# EAGLE schematic Cube_sch_3_16_13 (EAGLE 6.4), part 1 of 2
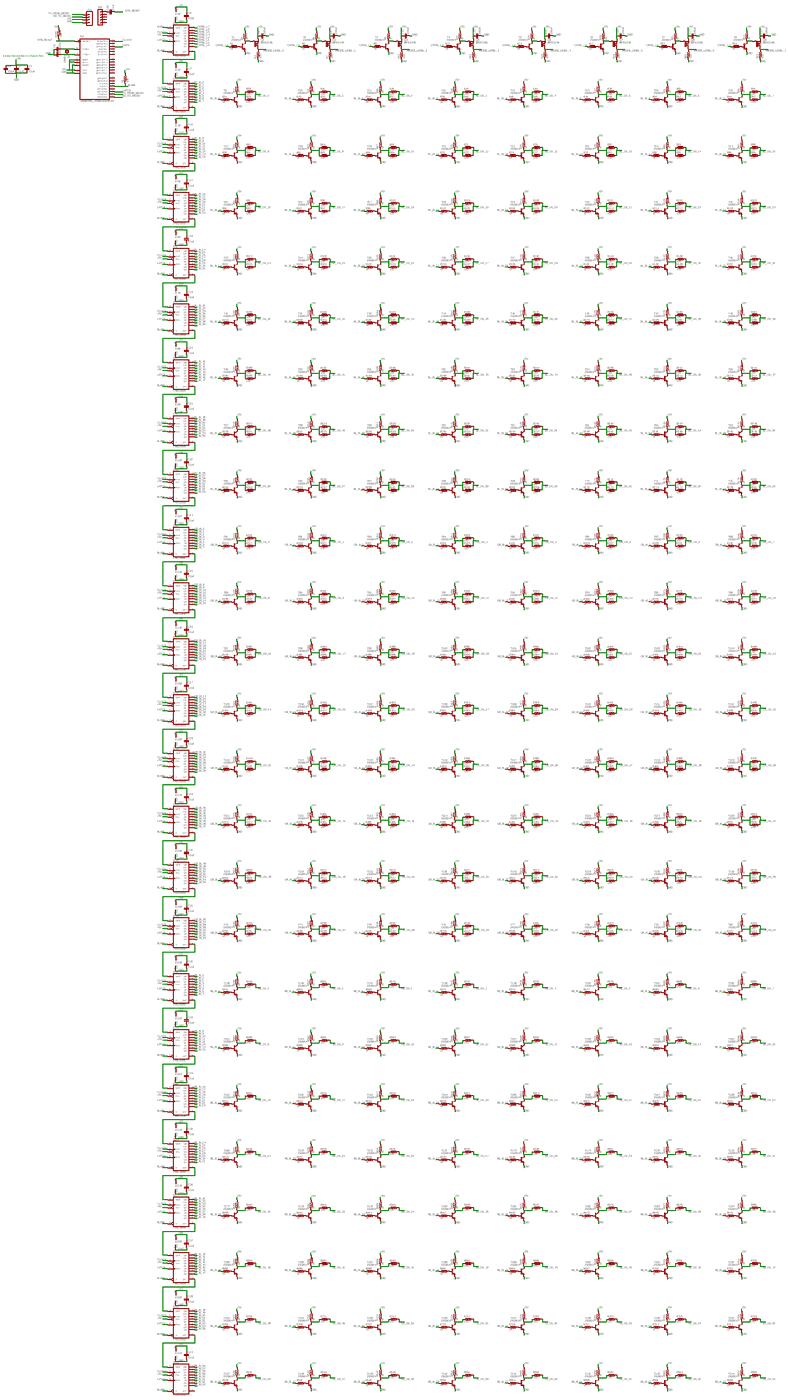
[diagram p0: schematic, sheet 1, overview]
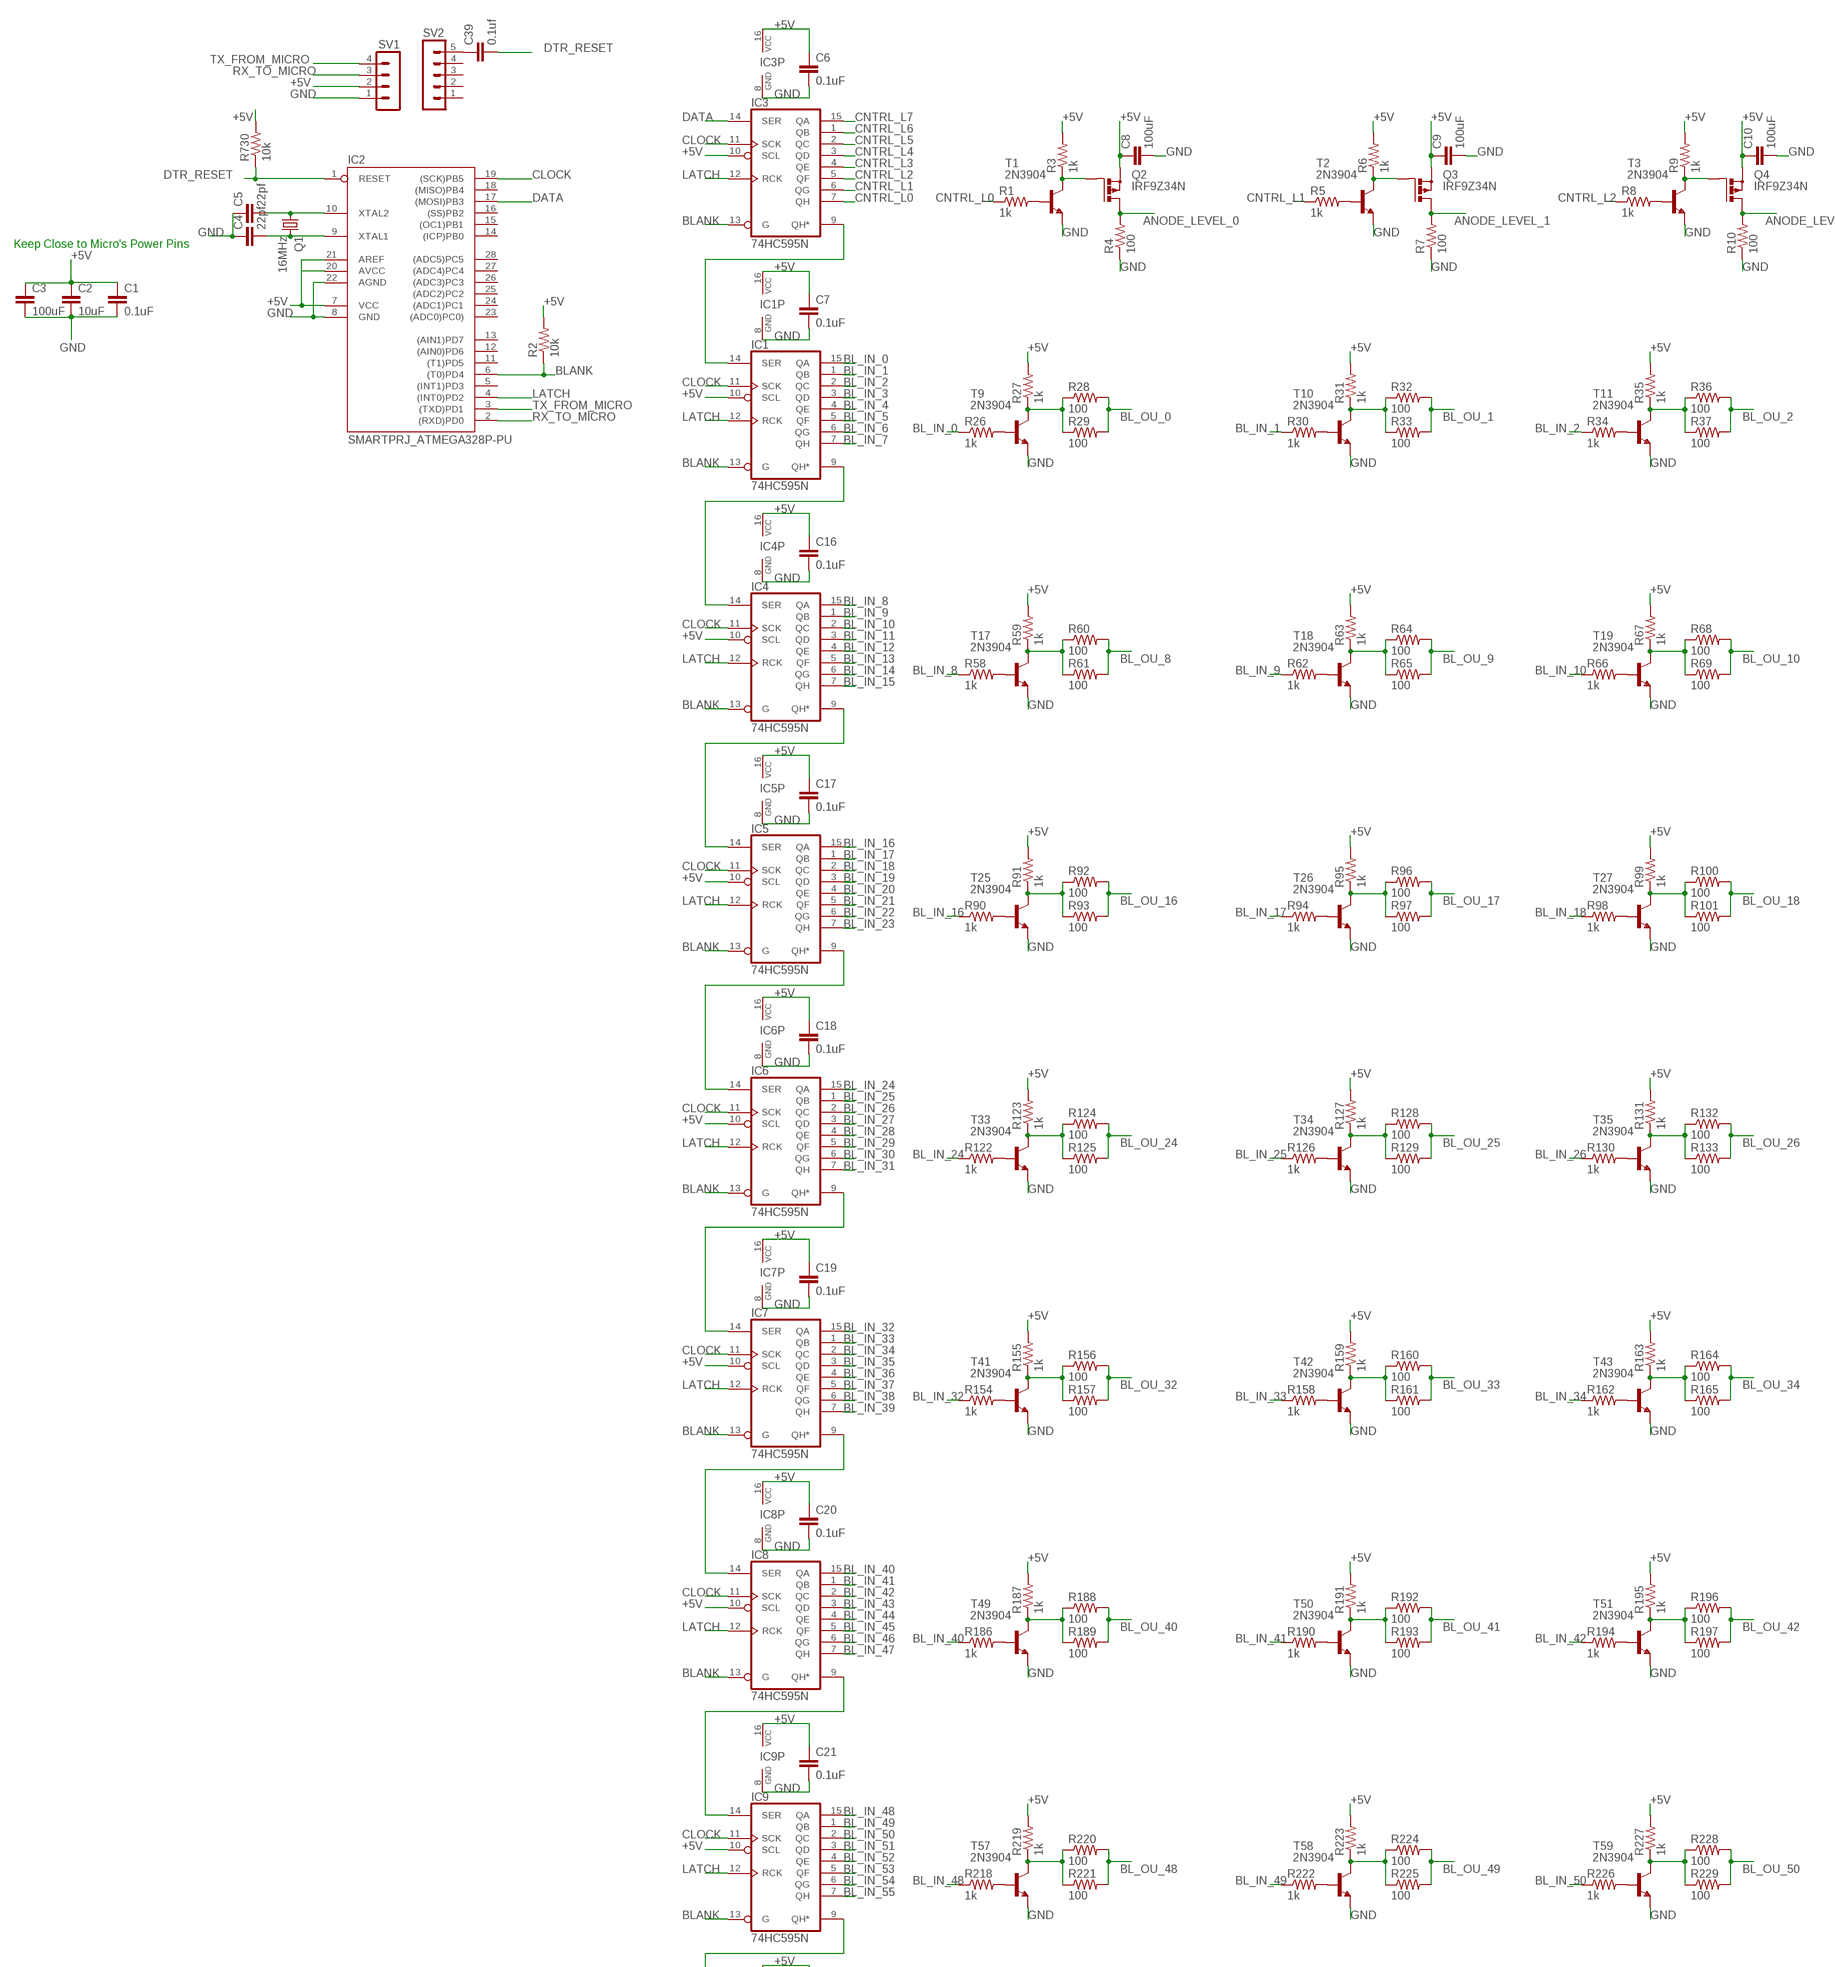
[diagram p1: schematic, sheet 1, part 1 of 8]
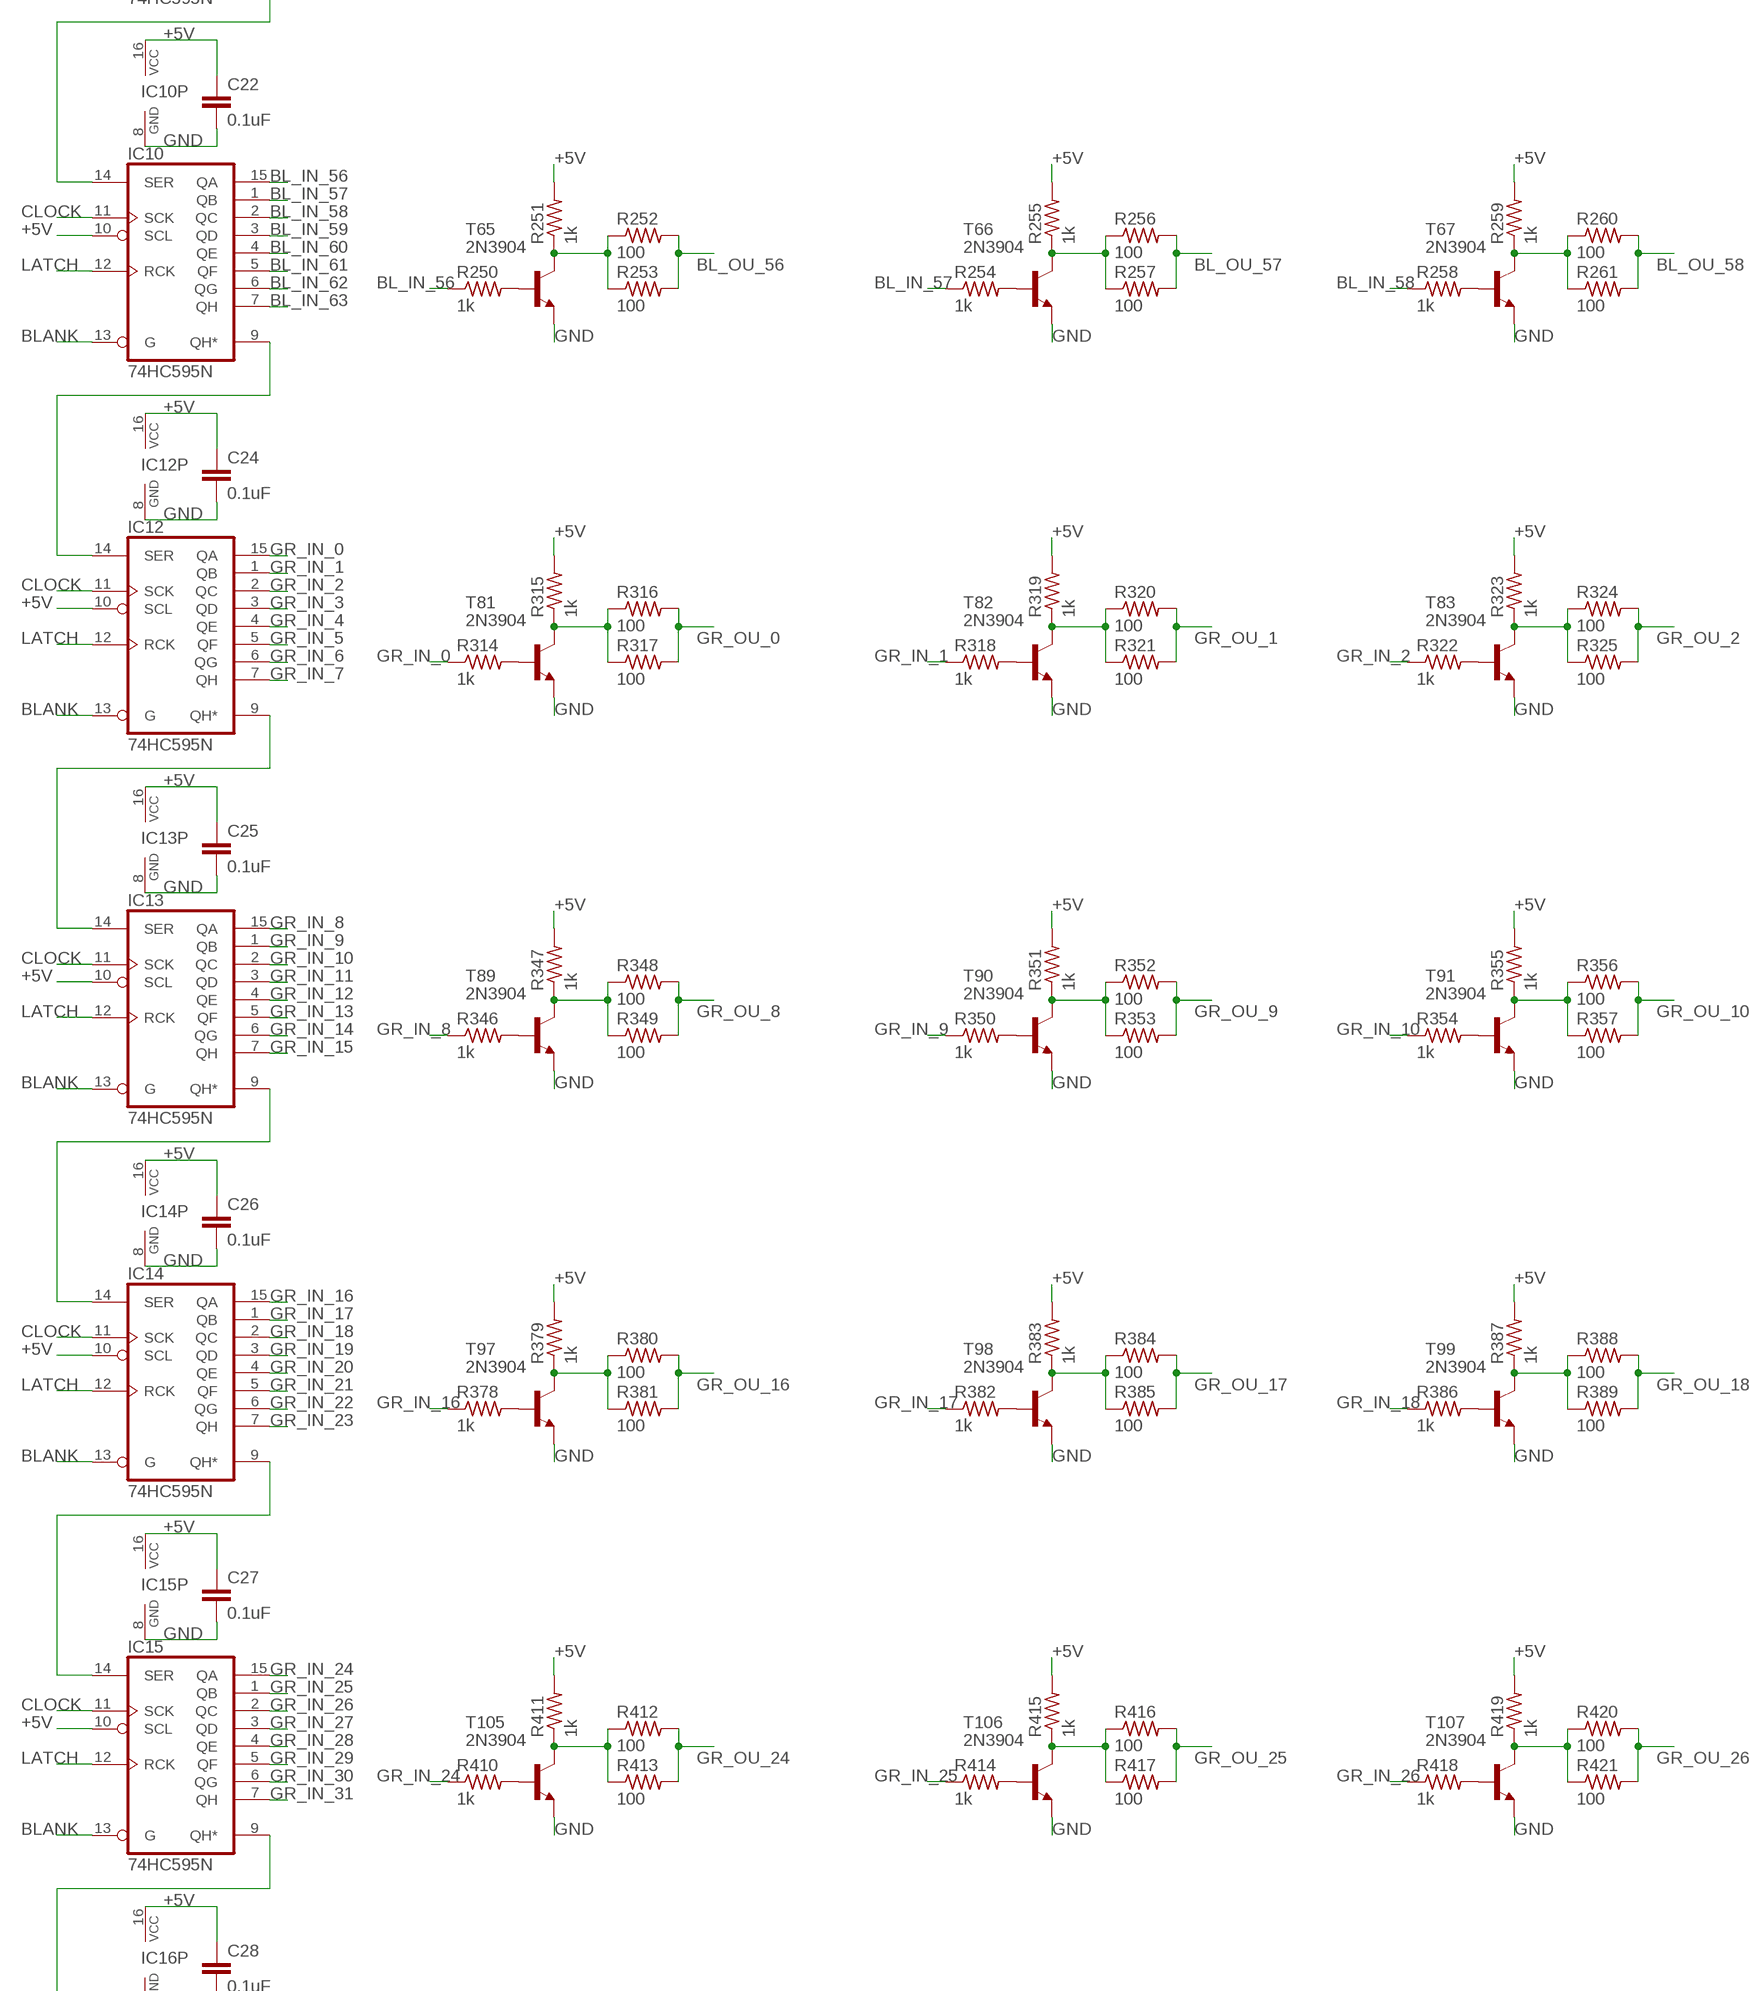
[diagram p2: schematic, sheet 1, part 2 of 8]
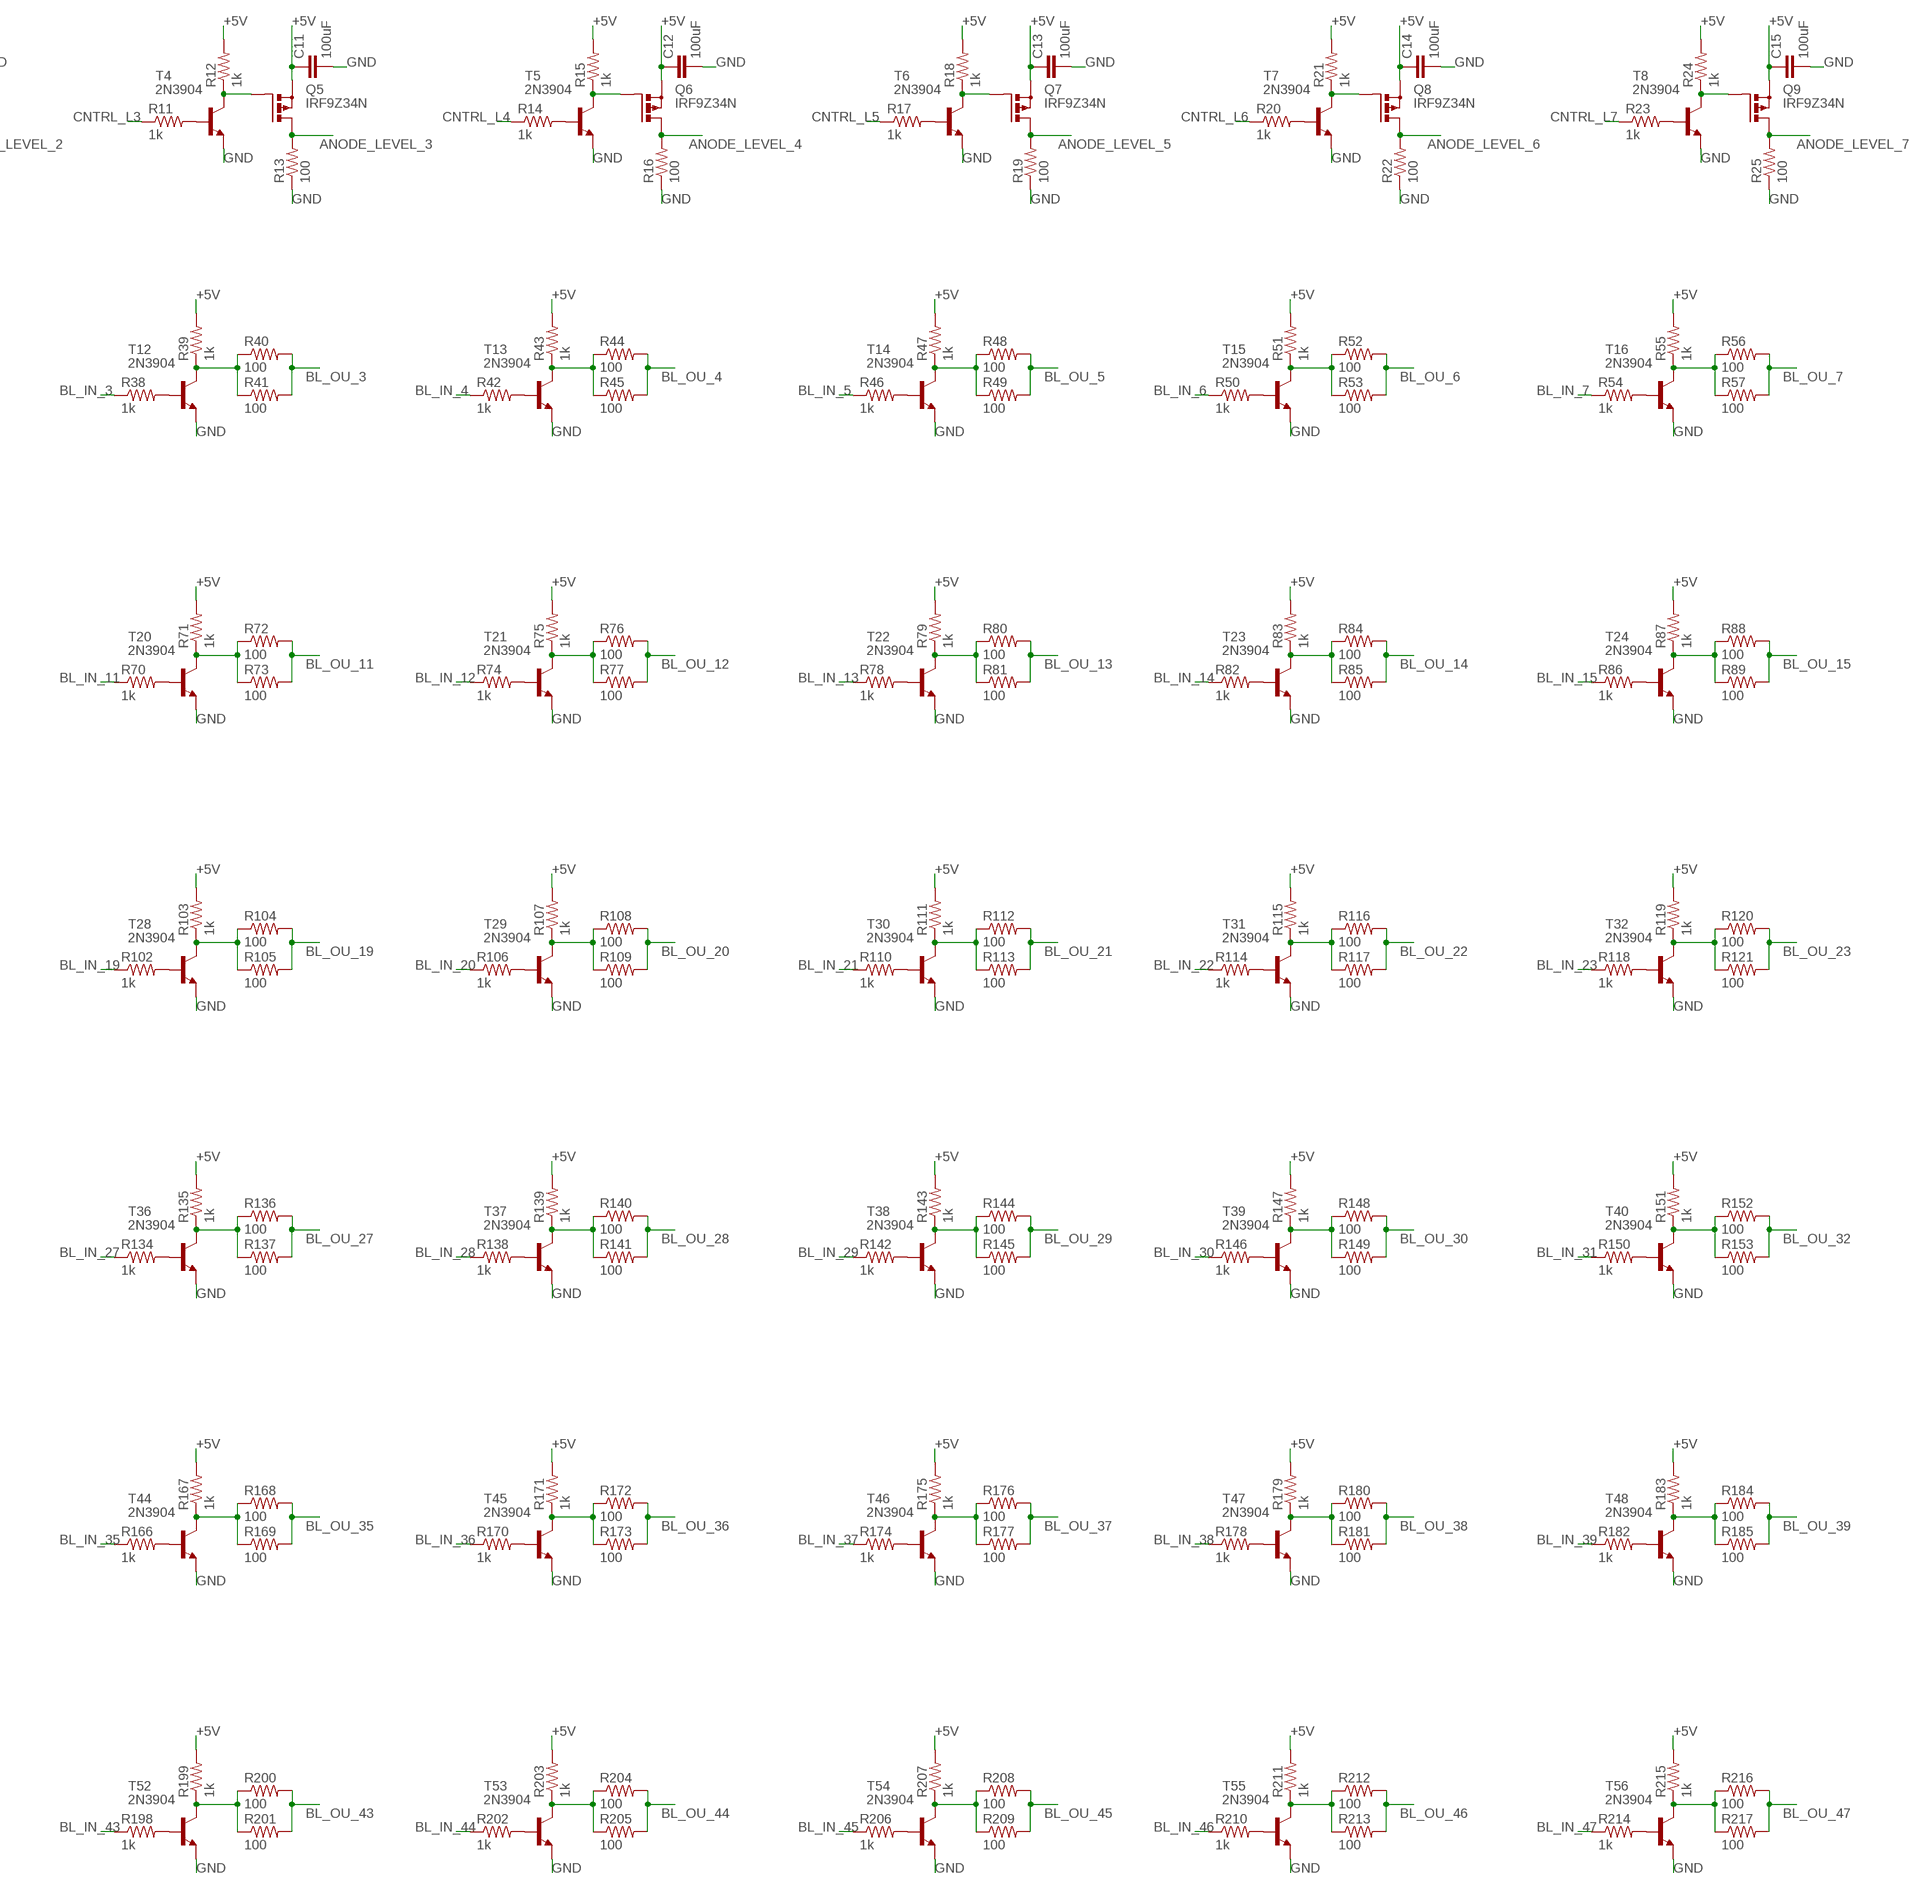
[diagram p3: schematic, sheet 1, part 3 of 8]
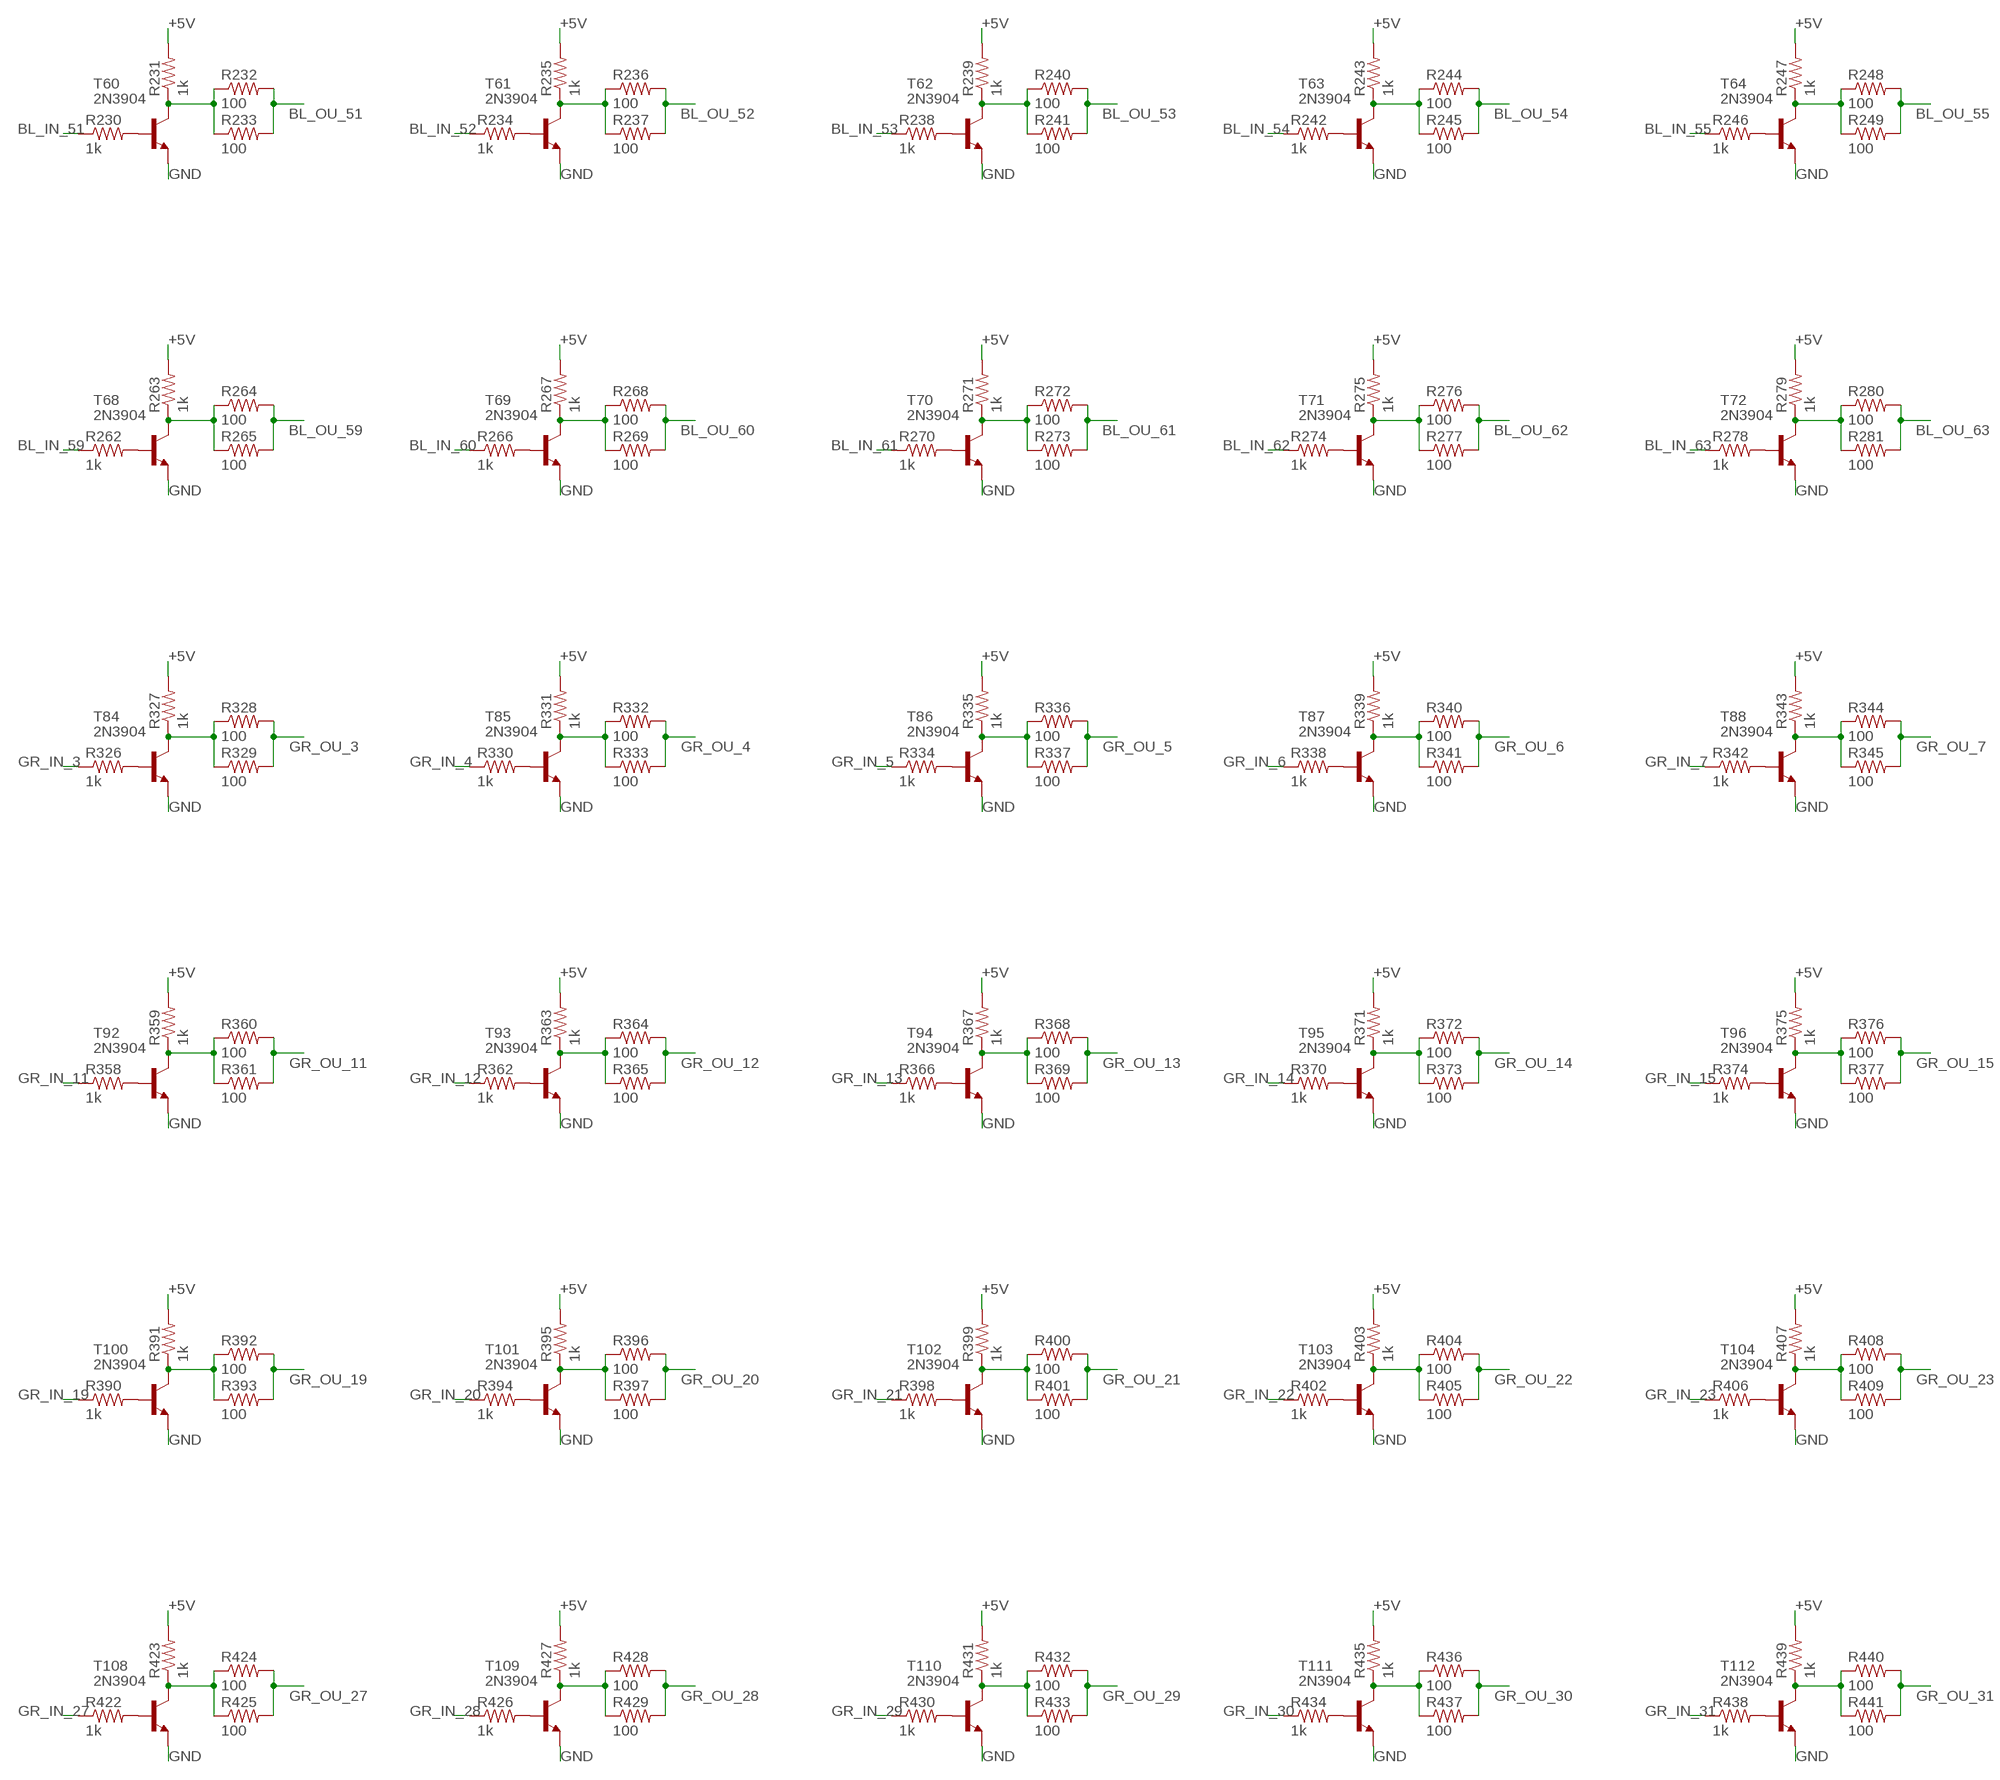
[diagram p4: schematic, sheet 1, part 4 of 8]
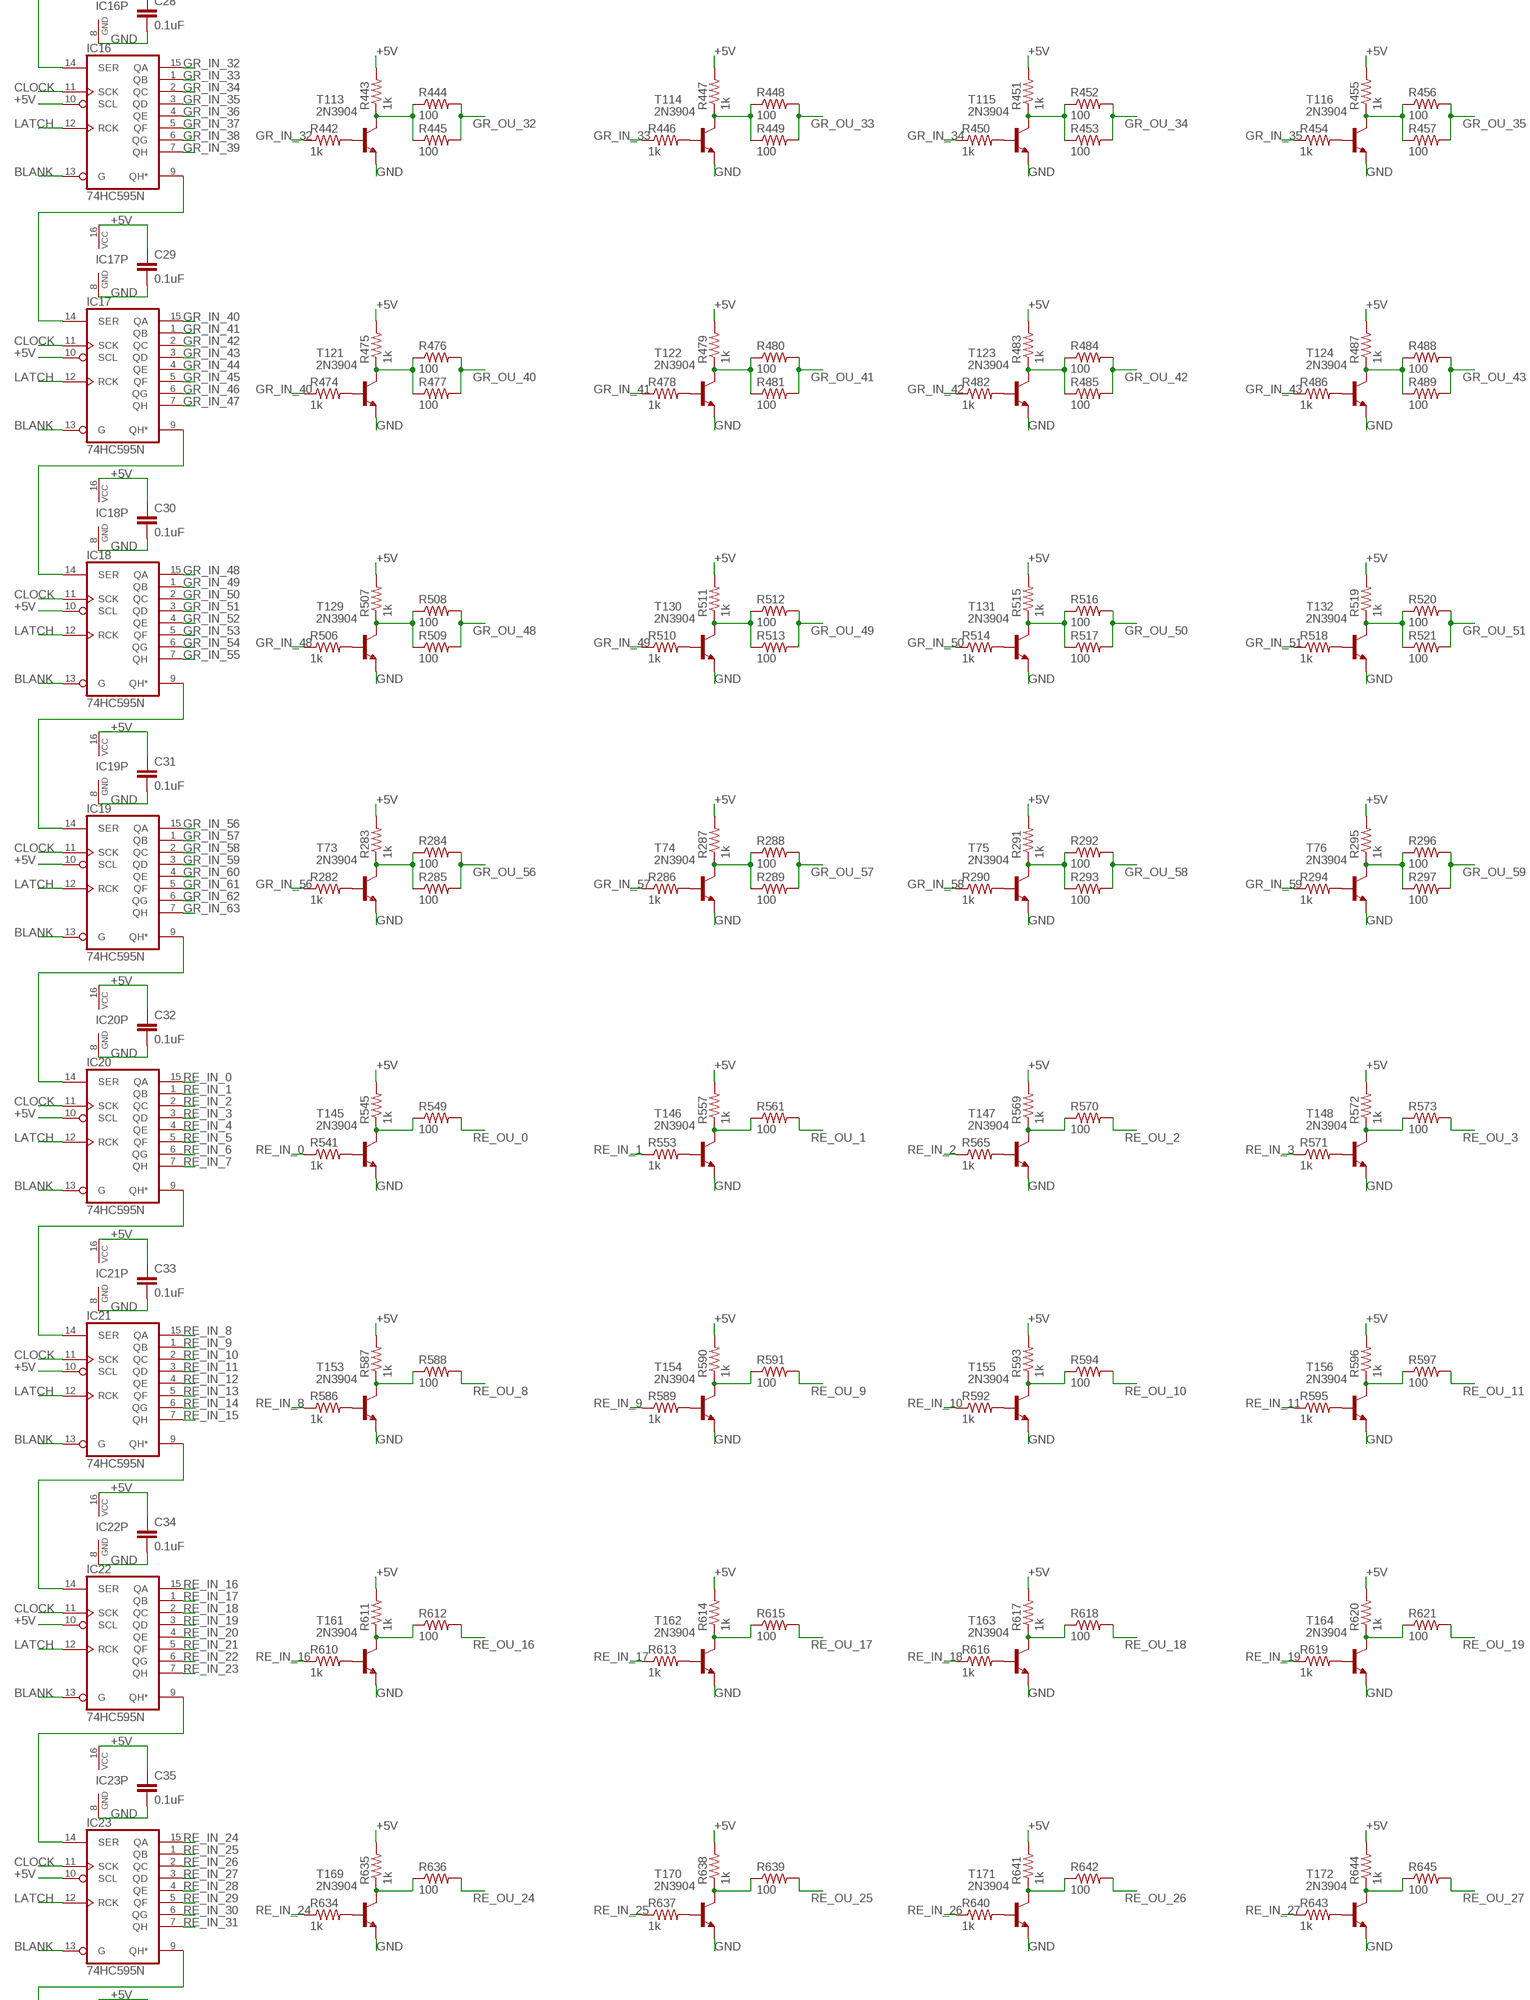
[diagram p5: schematic, sheet 1, part 5 of 8]
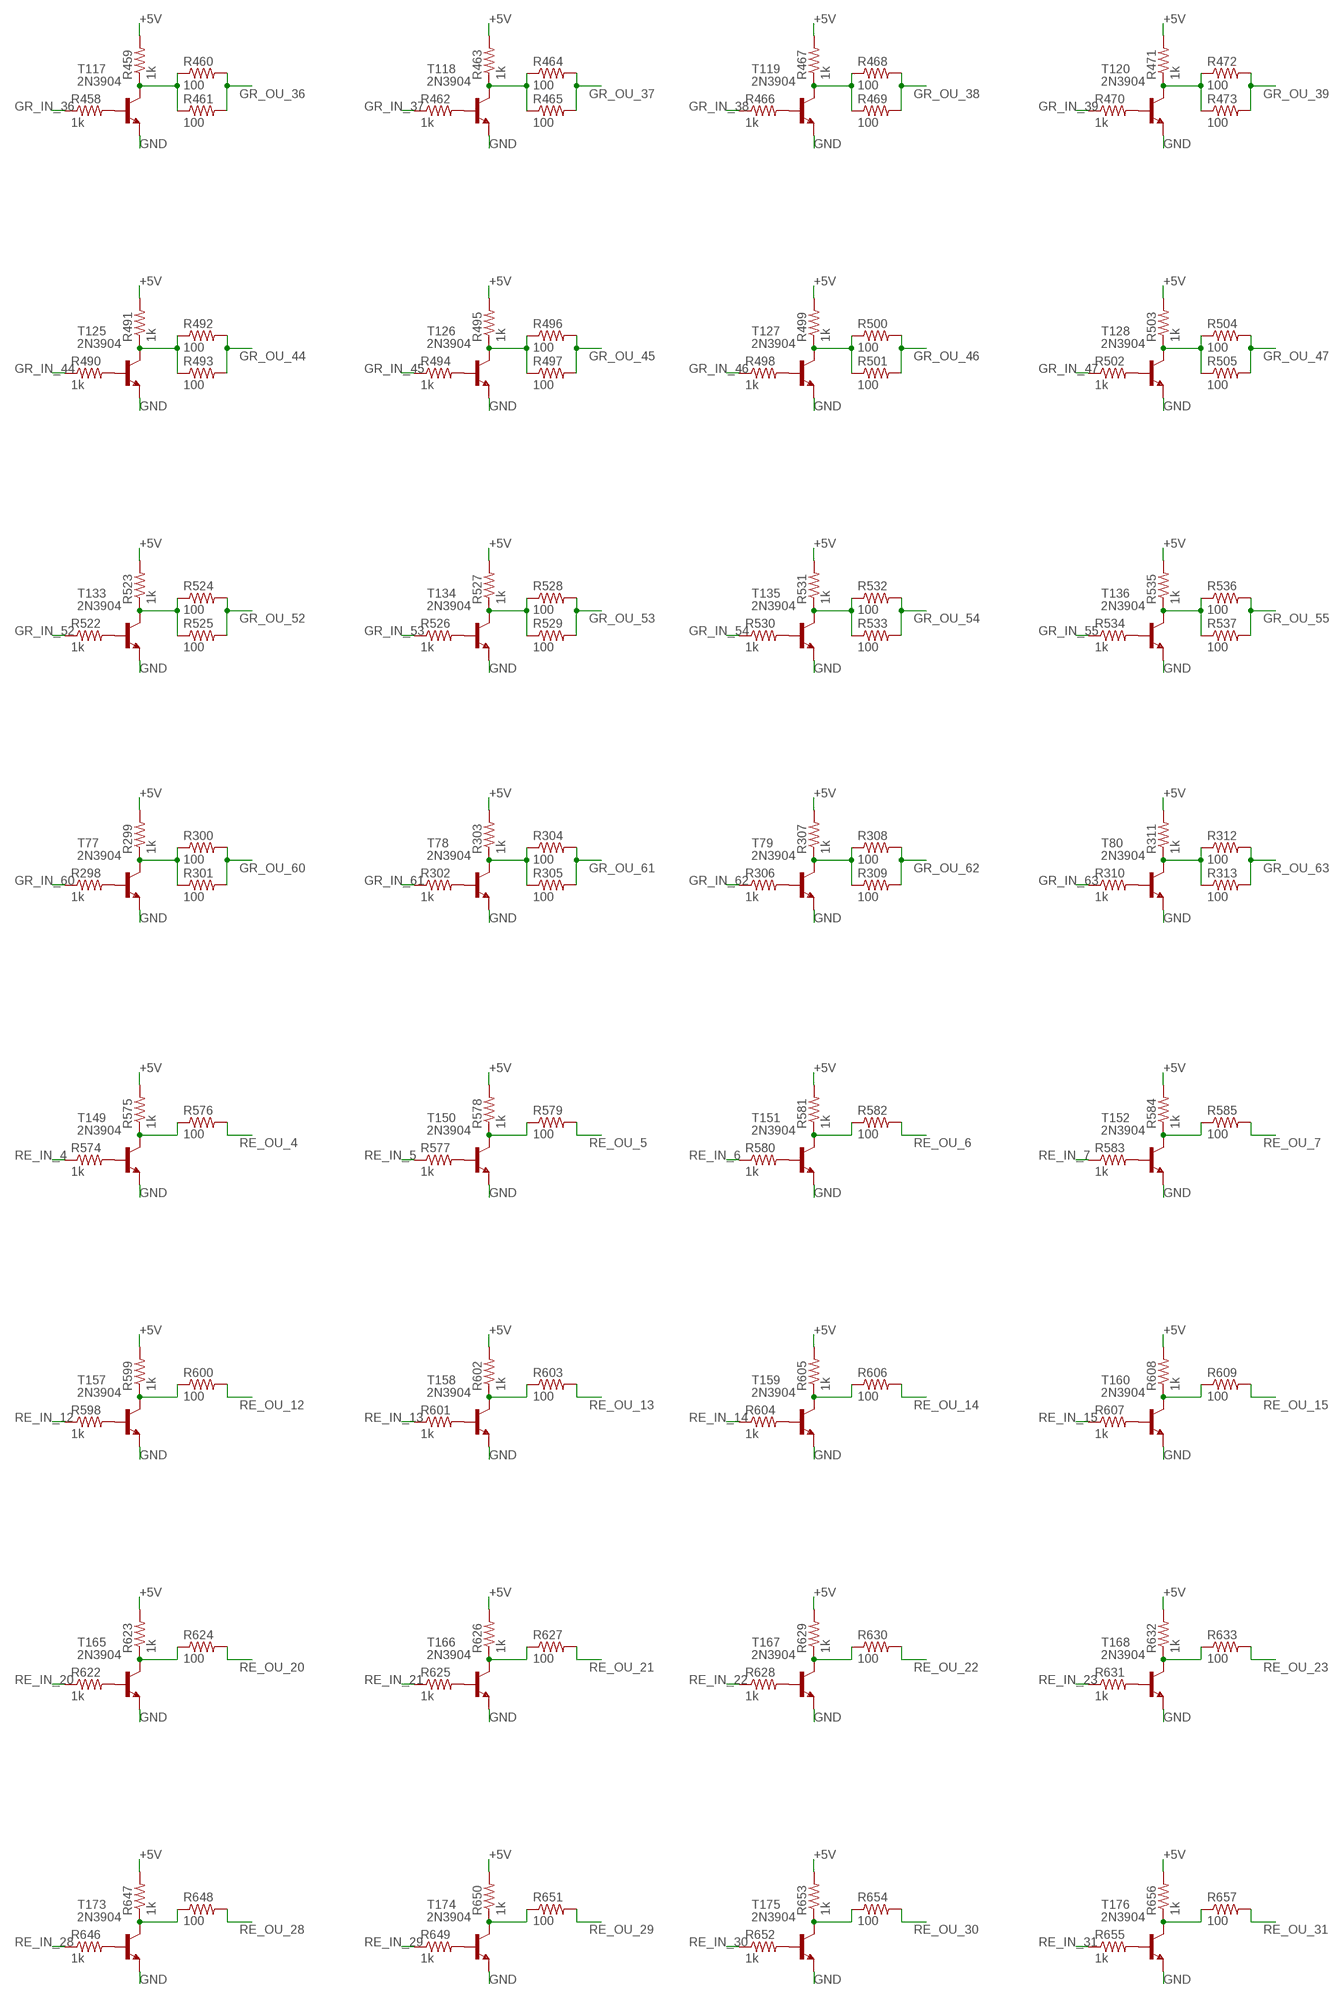
[diagram p6: schematic, sheet 1, part 6 of 8]
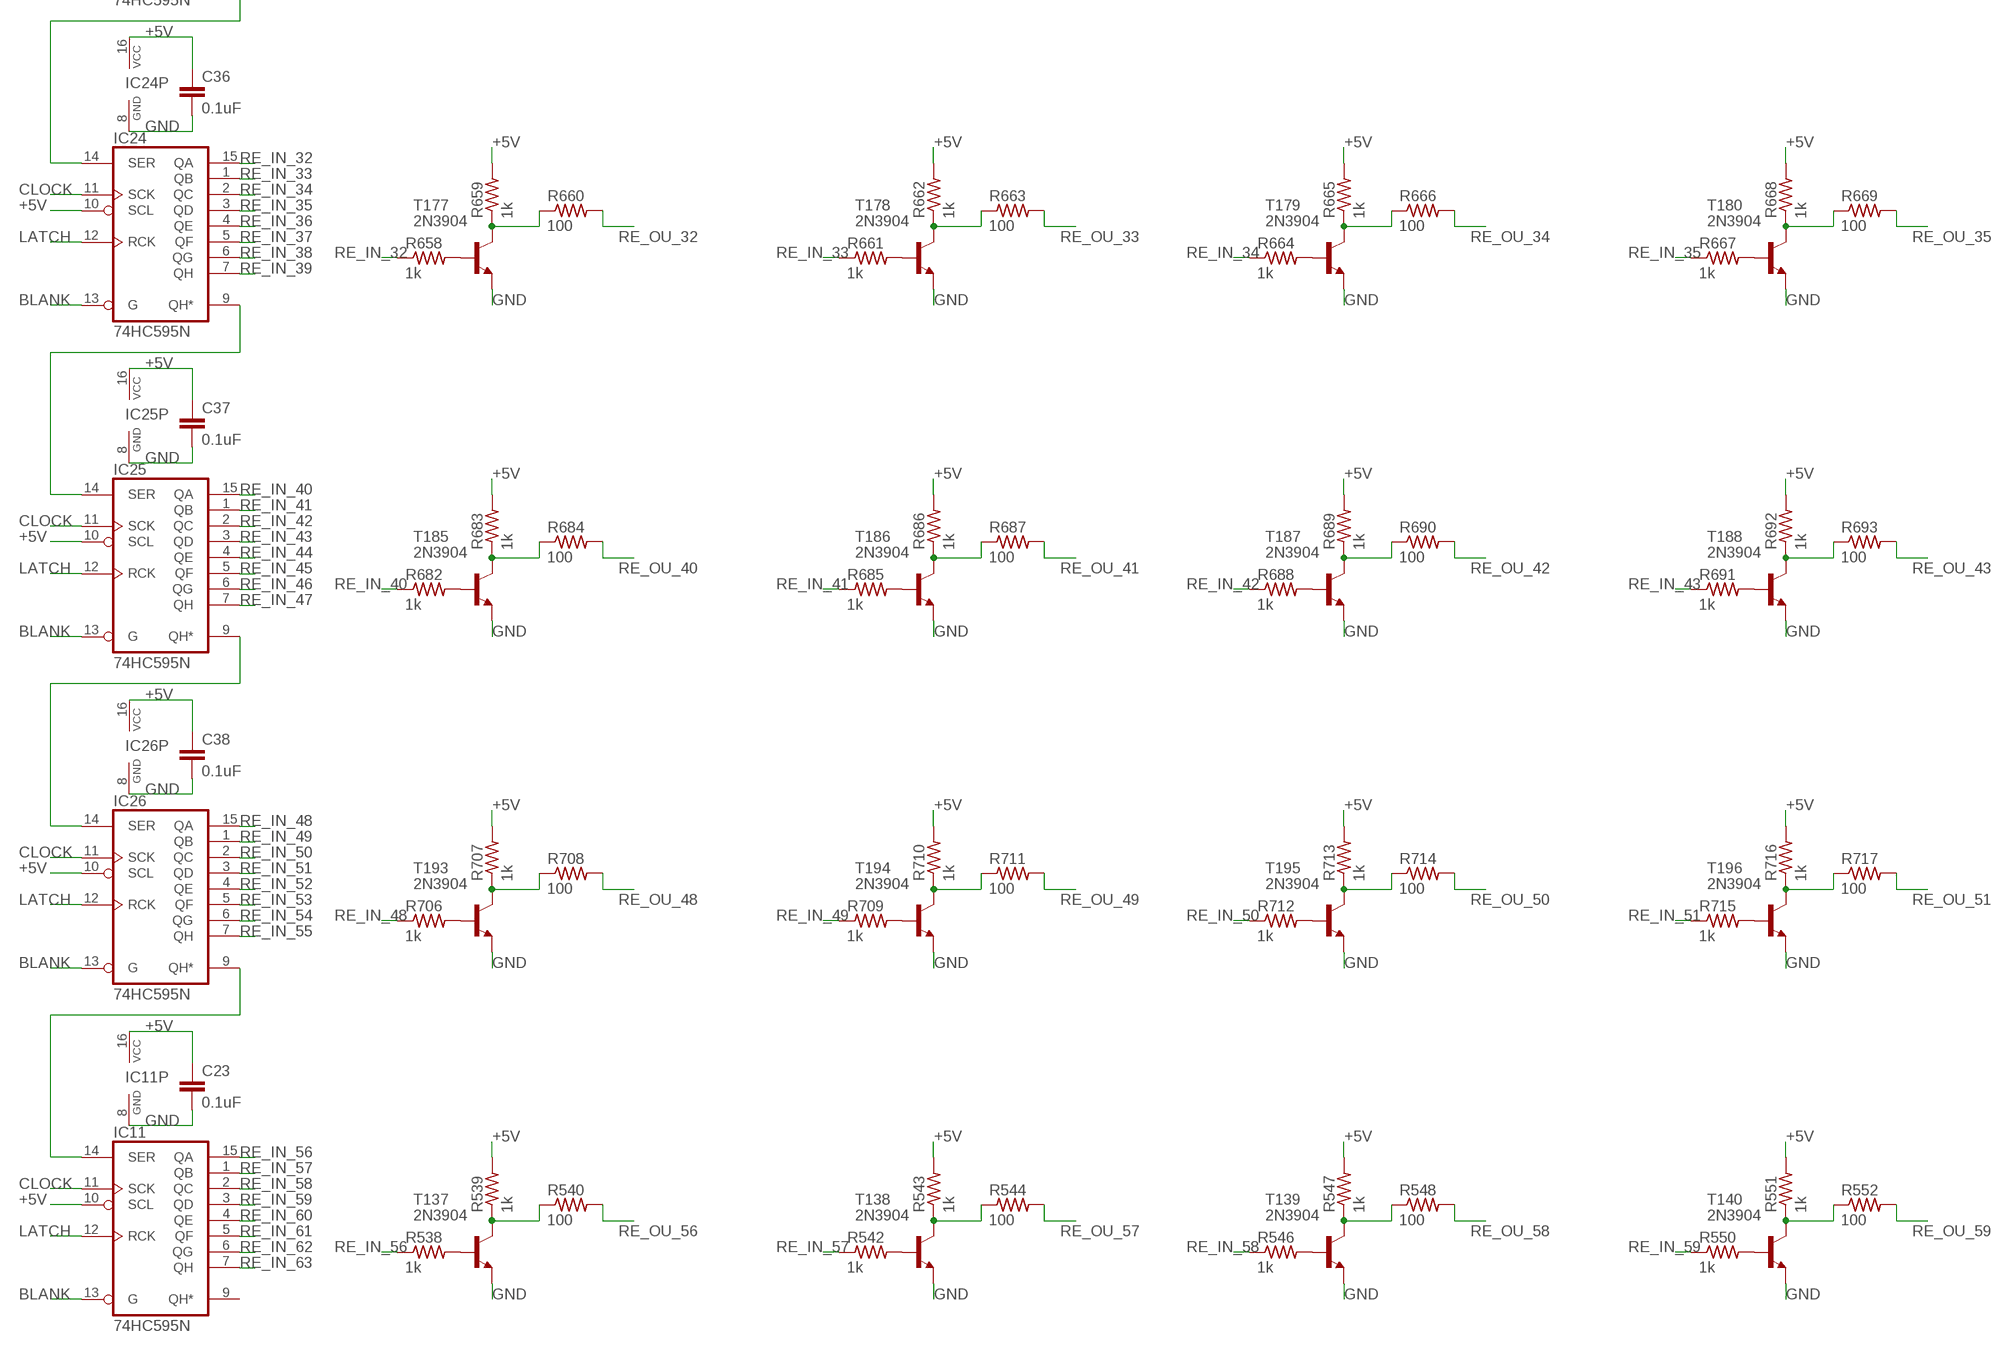
[diagram p7: schematic, sheet 1, part 7 of 8]
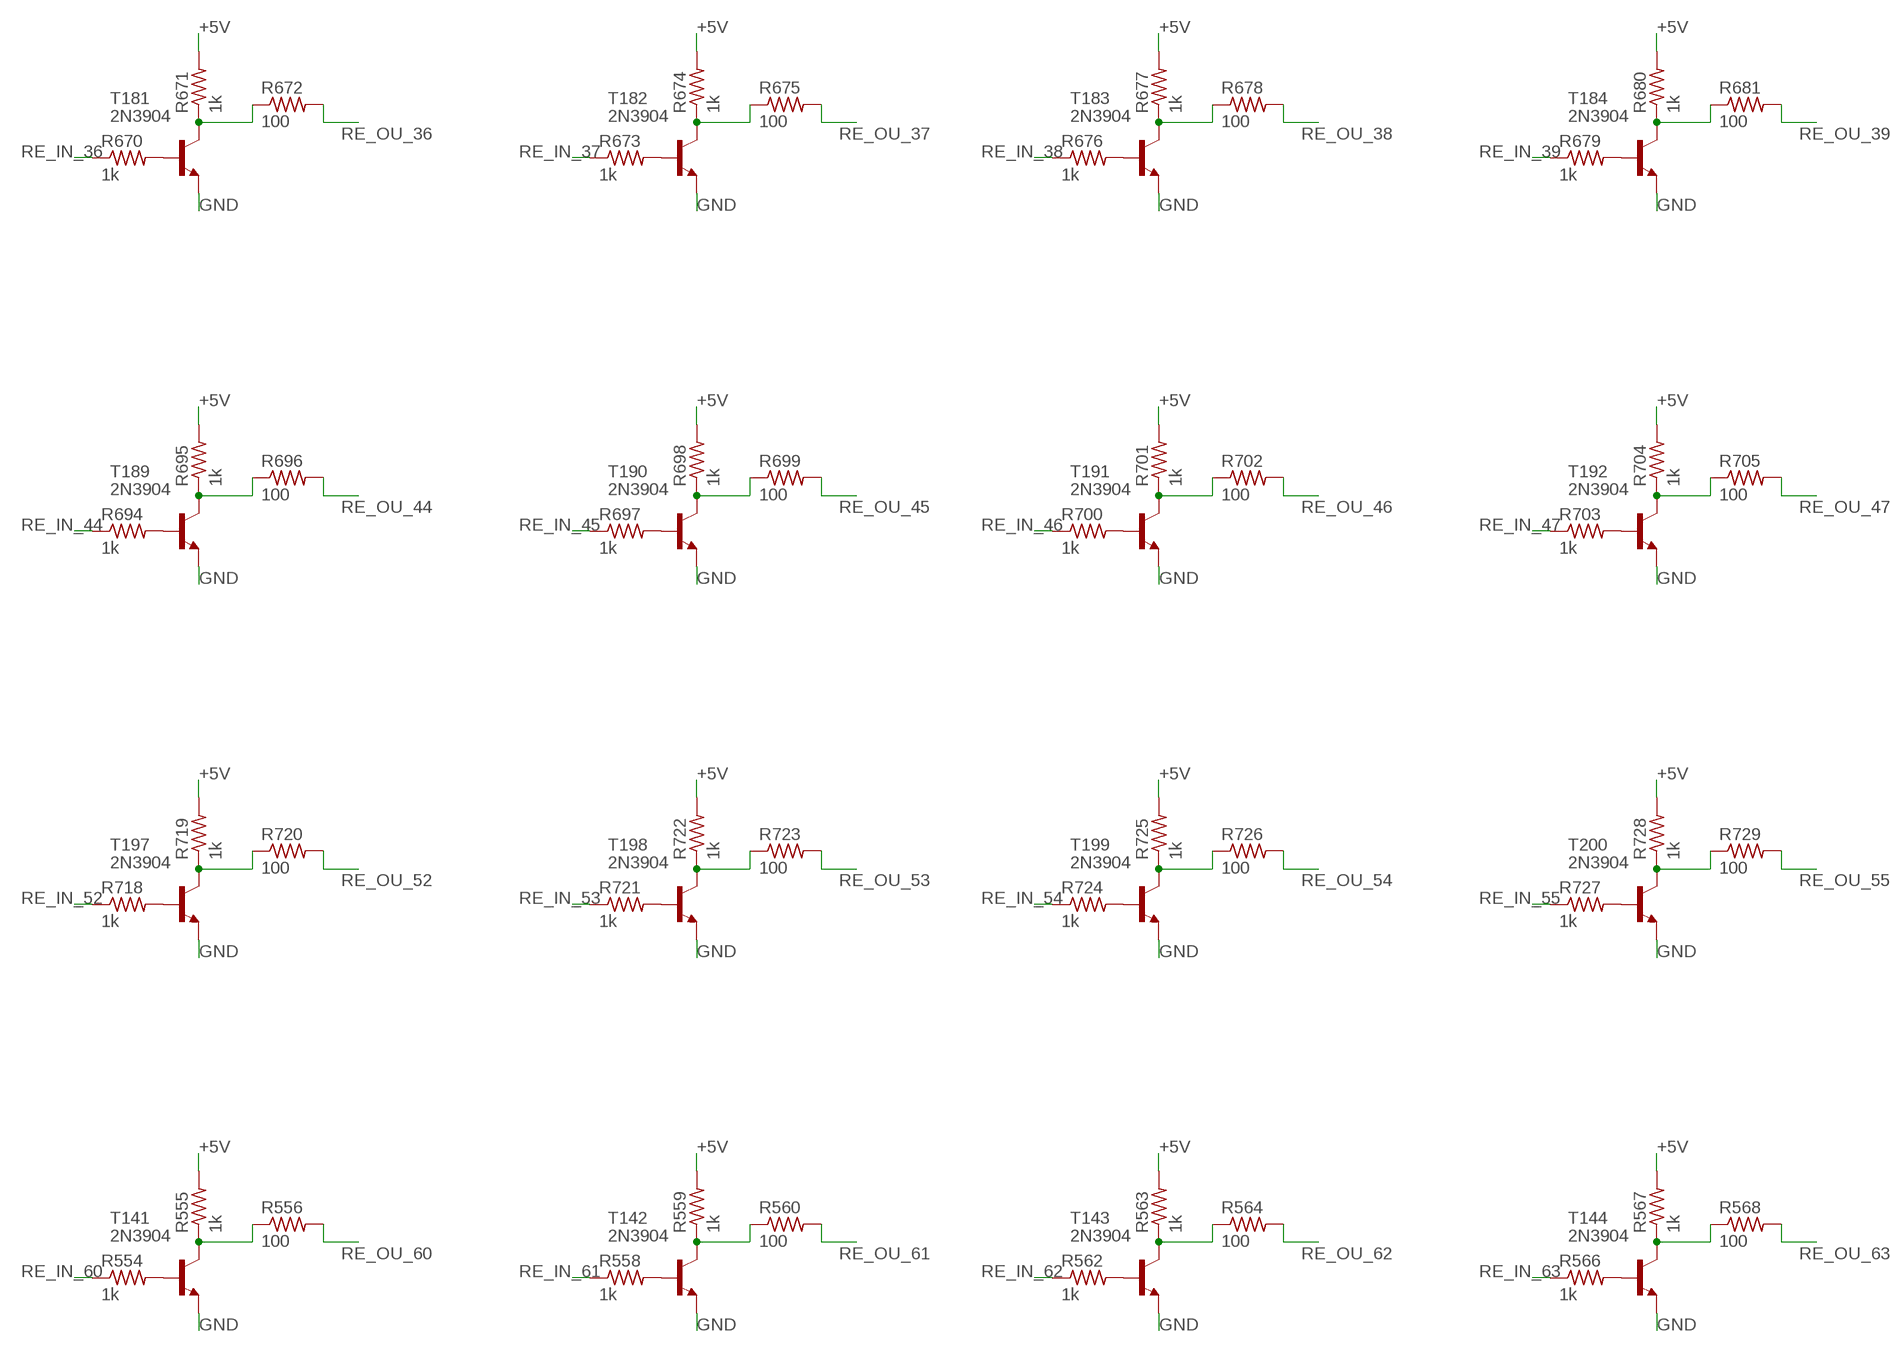
[diagram p8: schematic, sheet 1, part 8 of 8]

## Parts
C1  0.1uF  C2,5-3  [C2.5-3]
C2  10uF  C2,5-3  [C2.5-3]
C3  100uF  C2,5-3  [C2.5-3]
C4  22pf  C2,5-3  [C2.5-3]
C5  22pf  C2,5-3  [C2.5-3]
C6  0.1uF  C2,5-3  [C2.5-3]
C7  0.1uF  C2,5-3  [C2.5-3]
C8  100uF  C2,5-3  [C2.5-3]
C9  100uF  C2,5-3  [C2.5-3]
C10  100uF  C2,5-3  [C2.5-3]
C11  100uF  C2,5-3  [C2.5-3]
C12  100uF  C2,5-3  [C2.5-3]
C13  100uF  C2,5-3  [C2.5-3]
C14  100uF  C2,5-3  [C2.5-3]
C15  100uF  C2,5-3  [C2.5-3]
C16  0.1uF  C2,5-3  [C2.5-3]
C17  0.1uF  C2,5-3  [C2.5-3]
C18  0.1uF  C2,5-3  [C2.5-3]
C19  0.1uF  C2,5-3  [C2.5-3]
C20  0.1uF  C2,5-3  [C2.5-3]
C21  0.1uF  C2,5-3  [C2.5-3]
C22  0.1uF  C2,5-3  [C2.5-3]
C23  0.1uF  C2,5-3  [C2.5-3]
C24  0.1uF  C2,5-3  [C2.5-3]
C25  0.1uF  C2,5-3  [C2.5-3]
C26  0.1uF  C2,5-3  [C2.5-3]
C27  0.1uF  C2,5-3  [C2.5-3]
C28  0.1uF  C2,5-3  [C2.5-3]
C29  0.1uF  C2,5-3  [C2.5-3]
C30  0.1uF  C2,5-3  [C2.5-3]
C31  0.1uF  C2,5-3  [C2.5-3]
C32  0.1uF  C2,5-3  [C2.5-3]
C33  0.1uF  C2,5-3  [C2.5-3]
C34  0.1uF  C2,5-3  [C2.5-3]
C35  0.1uF  C2,5-3  [C2.5-3]
C36  0.1uF  C2,5-3  [C2.5-3]
C37  0.1uF  C2,5-3  [C2.5-3]
C38  0.1uF  C2,5-3  [C2.5-3]
C39  0.1uf  C2,5-3  [C2.5-3]
IC1  74HC595N  [DIL16]
IC2  SMARTPRJ_ATMEGA328P-PU  [SMARTPRJ_DIL28-3]
IC3  74HC595N  [DIL16]
IC4  74HC595N  [DIL16]
IC5  74HC595N  [DIL16]
IC6  74HC595N  [DIL16]
IC7  74HC595N  [DIL16]
IC8  74HC595N  [DIL16]
IC9  74HC595N  [DIL16]
IC10  74HC595N  [DIL16]
IC11  74HC595N  [DIL16]
IC12  74HC595N  [DIL16]
IC13  74HC595N  [DIL16]
IC14  74HC595N  [DIL16]
IC15  74HC595N  [DIL16]
IC16  74HC595N  [DIL16]
IC17  74HC595N  [DIL16]
IC18  74HC595N  [DIL16]
IC19  74HC595N  [DIL16]
IC20  74HC595N  [DIL16]
IC21  74HC595N  [DIL16]
IC22  74HC595N  [DIL16]
IC23  74HC595N  [DIL16]
IC24  74HC595N  [DIL16]
IC25  74HC595N  [DIL16]
IC26  74HC595N  [DIL16]
Q1  16MHz  CRYSTALHC49S  [HC49/S]
Q2  IRF9Z34N  PMOSFET_PTO220BV  [TO220BV]
Q3  IRF9Z34N  PMOSFET_PTO220BV  [TO220BV]
Q4  IRF9Z34N  PMOSFET_PTO220BV  [TO220BV]
Q5  IRF9Z34N  PMOSFET_PTO220BV  [TO220BV]
Q6  IRF9Z34N  PMOSFET_PTO220BV  [TO220BV]
Q7  IRF9Z34N  PMOSFET_PTO220BV  [TO220BV]
Q8  IRF9Z34N  PMOSFET_PTO220BV  [TO220BV]
Q9  IRF9Z34N  PMOSFET_PTO220BV  [TO220BV]
R1  1k  R-US_0204/5  [0204/5]
R2  10k  R-US_0204/5  [0204/5]
R3  1k  R-US_0204/5  [0204/5]
R4  100  R-US_0204/5  [0204/5]
R5  1k  R-US_0204/5  [0204/5]
R6  1k  R-US_0204/5  [0204/5]
R7  100  R-US_0204/5  [0204/5]
R8  1k  R-US_0204/5  [0204/5]
R9  1k  R-US_0204/5  [0204/5]
R10  100  R-US_0204/5  [0204/5]
R11  1k  R-US_0204/5  [0204/5]
R12  1k  R-US_0204/5  [0204/5]
R13  100  R-US_0204/5  [0204/5]
R14  1k  R-US_0204/5  [0204/5]
R15  1k  R-US_0204/5  [0204/5]
R16  100  R-US_0204/5  [0204/5]
R17  1k  R-US_0204/5  [0204/5]
R18  1k  R-US_0204/5  [0204/5]
R19  100  R-US_0204/5  [0204/5]
R20  1k  R-US_0204/5  [0204/5]
R21  1k  R-US_0204/5  [0204/5]
R22  100  R-US_0204/5  [0204/5]
R23  1k  R-US_0204/5  [0204/5]
R24  1k  R-US_0204/5  [0204/5]
R25  100  R-US_0204/5  [0204/5]
R26  1k  R-US_0204/5  [0204/5]
R27  1k  R-US_0204/5  [0204/5]
R28  100  R-US_0204/5  [0204/5]
R29  100  R-US_0204/5  [0204/5]
R30  1k  R-US_0204/5  [0204/5]
R31  1k  R-US_0204/5  [0204/5]
R32  100  R-US_0204/5  [0204/5]
R33  100  R-US_0204/5  [0204/5]
R34  1k  R-US_0204/5  [0204/5]
R35  1k  R-US_0204/5  [0204/5]
R36  100  R-US_0204/5  [0204/5]
R37  100  R-US_0204/5  [0204/5]
R38  1k  R-US_0204/5  [0204/5]
R39  1k  R-US_0204/5  [0204/5]
R40  100  R-US_0204/5  [0204/5]
R41  100  R-US_0204/5  [0204/5]
R42  1k  R-US_0204/5  [0204/5]
R43  1k  R-US_0204/5  [0204/5]
R44  100  R-US_0204/5  [0204/5]
R45  100  R-US_0204/5  [0204/5]
R46  1k  R-US_0204/5  [0204/5]
R47  1k  R-US_0204/5  [0204/5]
R48  100  R-US_0204/5  [0204/5]
R49  100  R-US_0204/5  [0204/5]
R50  1k  R-US_0204/5  [0204/5]
R51  1k  R-US_0204/5  [0204/5]
R52  100  R-US_0204/5  [0204/5]
R53  100  R-US_0204/5  [0204/5]
R54  1k  R-US_0204/5  [0204/5]
R55  1k  R-US_0204/5  [0204/5]
R56  100  R-US_0204/5  [0204/5]
R57  100  R-US_0204/5  [0204/5]
R58  1k  R-US_0204/5  [0204/5]
R59  1k  R-US_0204/5  [0204/5]
R60  100  R-US_0204/5  [0204/5]
R61  100  R-US_0204/5  [0204/5]
R62  1k  R-US_0204/5  [0204/5]
R63  1k  R-US_0204/5  [0204/5]
R64  100  R-US_0204/5  [0204/5]
R65  100  R-US_0204/5  [0204/5]
R66  1k  R-US_0204/5  [0204/5]
R67  1k  R-US_0204/5  [0204/5]
R68  100  R-US_0204/5  [0204/5]
R69  100  R-US_0204/5  [0204/5]
R70  1k  R-US_0204/5  [0204/5]
R71  1k  R-US_0204/5  [0204/5]
R72  100  R-US_0204/5  [0204/5]
R73  100  R-US_0204/5  [0204/5]
R74  1k  R-US_0204/5  [0204/5]
R75  1k  R-US_0204/5  [0204/5]
R76  100  R-US_0204/5  [0204/5]
R77  100  R-US_0204/5  [0204/5]
R78  1k  R-US_0204/5  [0204/5]
R79  1k  R-US_0204/5  [0204/5]
R80  100  R-US_0204/5  [0204/5]
R81  100  R-US_0204/5  [0204/5]
R82  1k  R-US_0204/5  [0204/5]
R83  1k  R-US_0204/5  [0204/5]
R84  100  R-US_0204/5  [0204/5]
R85  100  R-US_0204/5  [0204/5]
R86  1k  R-US_0204/5  [0204/5]
R87  1k  R-US_0204/5  [0204/5]
R88  100  R-US_0204/5  [0204/5]
R89  100  R-US_0204/5  [0204/5]
R90  1k  R-US_0204/5  [0204/5]
R91  1k  R-US_0204/5  [0204/5]
R92  100  R-US_0204/5  [0204/5]
R93  100  R-US_0204/5  [0204/5]
R94  1k  R-US_0204/5  [0204/5]
R95  1k  R-US_0204/5  [0204/5]
R96  100  R-US_0204/5  [0204/5]
R97  100  R-US_0204/5  [0204/5]
R98  1k  R-US_0204/5  [0204/5]
R99  1k  R-US_0204/5  [0204/5]
R100  100  R-US_0204/5  [0204/5]
R101  100  R-US_0204/5  [0204/5]
R102  1k  R-US_0204/5  [0204/5]
R103  1k  R-US_0204/5  [0204/5]
R104  100  R-US_0204/5  [0204/5]
R105  100  R-US_0204/5  [0204/5]
R106  1k  R-US_0204/5  [0204/5]
R107  1k  R-US_0204/5  [0204/5]
R108  100  R-US_0204/5  [0204/5]
R109  100  R-US_0204/5  [0204/5]
R110  1k  R-US_0204/5  [0204/5]
R111  1k  R-US_0204/5  [0204/5]
R112  100  R-US_0204/5  [0204/5]
R113  100  R-US_0204/5  [0204/5]
R114  1k  R-US_0204/5  [0204/5]
R115  1k  R-US_0204/5  [0204/5]
R116  100  R-US_0204/5  [0204/5]
R117  100  R-US_0204/5  [0204/5]
R118  1k  R-US_0204/5  [0204/5]
R119  1k  R-US_0204/5  [0204/5]
R120  100  R-US_0204/5  [0204/5]
R121  100  R-US_0204/5  [0204/5]
R122  1k  R-US_0204/5  [0204/5]
R123  1k  R-US_0204/5  [0204/5]
R124  100  R-US_0204/5  [0204/5]
R125  100  R-US_0204/5  [0204/5]
R126  1k  R-US_0204/5  [0204/5]
R127  1k  R-US_0204/5  [0204/5]
R128  100  R-US_0204/5  [0204/5]
R129  100  R-US_0204/5  [0204/5]
R130  1k  R-US_0204/5  [0204/5]
R131  1k  R-US_0204/5  [0204/5]
R132  100  R-US_0204/5  [0204/5]
R133  100  R-US_0204/5  [0204/5]
R134  1k  R-US_0204/5  [0204/5]
R135  1k  R-US_0204/5  [0204/5]
R136  100  R-US_0204/5  [0204/5]
R137  100  R-US_0204/5  [0204/5]
R138  1k  R-US_0204/5  [0204/5]
R139  1k  R-US_0204/5  [0204/5]
R140  100  R-US_0204/5  [0204/5]
R141  100  R-US_0204/5  [0204/5]
R142  1k  R-US_0204/5  [0204/5]
R143  1k  R-US_0204/5  [0204/5]
R144  100  R-US_0204/5  [0204/5]
R145  100  R-US_0204/5  [0204/5]
R146  1k  R-US_0204/5  [0204/5]
R147  1k  R-US_0204/5  [0204/5]
R148  100  R-US_0204/5  [0204/5]
R149  100  R-US_0204/5  [0204/5]
R150  1k  R-US_0204/5  [0204/5]
R151  1k  R-US_0204/5  [0204/5]
R152  100  R-US_0204/5  [0204/5]
R153  100  R-US_0204/5  [0204/5]
R154  1k  R-US_0204/5  [0204/5]
R155  1k  R-US_0204/5  [0204/5]
R156  100  R-US_0204/5  [0204/5]
R157  100  R-US_0204/5  [0204/5]
R158  1k  R-US_0204/5  [0204/5]
R159  1k  R-US_0204/5  [0204/5]
R160  100  R-US_0204/5  [0204/5]
R161  100  R-US_0204/5  [0204/5]
R162  1k  R-US_0204/5  [0204/5]
R163  1k  R-US_0204/5  [0204/5]
R164  100  R-US_0204/5  [0204/5]
R165  100  R-US_0204/5  [0204/5]
R166  1k  R-US_0204/5  [0204/5]
R167  1k  R-US_0204/5  [0204/5]
R168  100  R-US_0204/5  [0204/5]
R169  100  R-US_0204/5  [0204/5]
R170  1k  R-US_0204/5  [0204/5]
R171  1k  R-US_0204/5  [0204/5]
R172  100  R-US_0204/5  [0204/5]
R173  100  R-US_0204/5  [0204/5]
R174  1k  R-US_0204/5  [0204/5]
R175  1k  R-US_0204/5  [0204/5]
R176  100  R-US_0204/5  [0204/5]
R177  100  R-US_0204/5  [0204/5]
R178  1k  R-US_0204/5  [0204/5]
R179  1k  R-US_0204/5  [0204/5]
R180  100  R-US_0204/5  [0204/5]
R181  100  R-US_0204/5  [0204/5]
R182  1k  R-US_0204/5  [0204/5]
R183  1k  R-US_0204/5  [0204/5]
R184  100  R-US_0204/5  [0204/5]
R185  100  R-US_0204/5  [0204/5]
R186  1k  R-US_0204/5  [0204/5]
R187  1k  R-US_0204/5  [0204/5]
R188  100  R-US_0204/5  [0204/5]
R189  100  R-US_0204/5  [0204/5]
R190  1k  R-US_0204/5  [0204/5]
R191  1k  R-US_0204/5  [0204/5]
R192  100  R-US_0204/5  [0204/5]
R193  100  R-US_0204/5  [0204/5]
R194  1k  R-US_0204/5  [0204/5]
R195  1k  R-US_0204/5  [0204/5]
R196  100  R-US_0204/5  [0204/5]
R197  100  R-US_0204/5  [0204/5]
R198  1k  R-US_0204/5  [0204/5]
R199  1k  R-US_0204/5  [0204/5]
R200  100  R-US_0204/5  [0204/5]
R201  100  R-US_0204/5  [0204/5]
R202  1k  R-US_0204/5  [0204/5]
R203  1k  R-US_0204/5  [0204/5]
R204  100  R-US_0204/5  [0204/5]
R205  100  R-US_0204/5  [0204/5]
R206  1k  R-US_0204/5  [0204/5]
R207  1k  R-US_0204/5  [0204/5]
R208  100  R-US_0204/5  [0204/5]
R209  100  R-US_0204/5  [0204/5]
R210  1k  R-US_0204/5  [0204/5]
R211  1k  R-US_0204/5  [0204/5]
R212  100  R-US_0204/5  [0204/5]
R213  100  R-US_0204/5  [0204/5]
R214  1k  R-US_0204/5  [0204/5]
R215  1k  R-US_0204/5  [0204/5]
R216  100  R-US_0204/5  [0204/5]
R217  100  R-US_0204/5  [0204/5]
R218  1k  R-US_0204/5  [0204/5]
R219  1k  R-US_0204/5  [0204/5]
R220  100  R-US_0204/5  [0204/5]
R221  100  R-US_0204/5  [0204/5]
R222  1k  R-US_0204/5  [0204/5]
R223  1k  R-US_0204/5  [0204/5]
R224  100  R-US_0204/5  [0204/5]
R225  100  R-US_0204/5  [0204/5]
R226  1k  R-US_0204/5  [0204/5]
R227  1k  R-US_0204/5  [0204/5]
R228  100  R-US_0204/5  [0204/5]
R229  100  R-US_0204/5  [0204/5]
R230  1k  R-US_0204/5  [0204/5]
R231  1k  R-US_0204/5  [0204/5]
R232  100  R-US_0204/5  [0204/5]
R233  100  R-US_0204/5  [0204/5]
R234  1k  R-US_0204/5  [0204/5]
R235  1k  R-US_0204/5  [0204/5]
R236  100  R-US_0204/5  [0204/5]
R237  100  R-US_0204/5  [0204/5]
R238  1k  R-US_0204/5  [0204/5]
R239  1k  R-US_0204/5  [0204/5]
R240  100  R-US_0204/5  [0204/5]
R241  100  R-US_0204/5  [0204/5]
R242  1k  R-US_0204/5  [0204/5]
R243  1k  R-US_0204/5  [0204/5]
R244  100  R-US_0204/5  [0204/5]
R245  100  R-US_0204/5  [0204/5]
R246  1k  R-US_0204/5  [0204/5]
R247  1k  R-US_0204/5  [0204/5]
R248  100  R-US_0204/5  [0204/5]
R249  100  R-US_0204/5  [0204/5]
R250  1k  R-US_0204/5  [0204/5]
R251  1k  R-US_0204/5  [0204/5]
R252  100  R-US_0204/5  [0204/5]
R253  100  R-US_0204/5  [0204/5]
R254  1k  R-US_0204/5  [0204/5]
R255  1k  R-US_0204/5  [0204/5]
R256  100  R-US_0204/5  [0204/5]
R257  100  R-US_0204/5  [0204/5]
R258  1k  R-US_0204/5  [0204/5]
R259  1k  R-US_0204/5  [0204/5]
R260  100  R-US_0204/5  [0204/5]
R261  100  R-US_0204/5  [0204/5]
R262  1k  R-US_0204/5  [0204/5]
R263  1k  R-US_0204/5  [0204/5]
R264  100  R-US_0204/5  [0204/5]
R265  100  R-US_0204/5  [0204/5]
R266  1k  R-US_0204/5  [0204/5]
R267  1k  R-US_0204/5  [0204/5]
R268  100  R-US_0204/5  [0204/5]
R269  100  R-US_0204/5  [0204/5]
R270  1k  R-US_0204/5  [0204/5]
R271  1k  R-US_0204/5  [0204/5]
R272  100  R-US_0204/5  [0204/5]
R273  100  R-US_0204/5  [0204/5]
R274  1k  R-US_0204/5  [0204/5]
R275  1k  R-US_0204/5  [0204/5]
R276  100  R-US_0204/5  [0204/5]
R277  100  R-US_0204/5  [0204/5]
R278  1k  R-US_0204/5  [0204/5]
R279  1k  R-US_0204/5  [0204/5]
R280  100  R-US_0204/5  [0204/5]
R281  100  R-US_0204/5  [0204/5]
R282  1k  R-US_0204/5  [0204/5]
R283  1k  R-US_0204/5  [0204/5]
R284  100  R-US_0204/5  [0204/5]
R285  100  R-US_0204/5  [0204/5]
R286  1k  R-US_0204/5  [0204/5]
R287  1k  R-US_0204/5  [0204/5]
R288  100  R-US_0204/5  [0204/5]
R289  100  R-US_0204/5  [0204/5]
R290  1k  R-US_0204/5  [0204/5]
R291  1k  R-US_0204/5  [0204/5]
R292  100  R-US_0204/5  [0204/5]
R293  100  R-US_0204/5  [0204/5]
R294  1k  R-US_0204/5  [0204/5]
R295  1k  R-US_0204/5  [0204/5]
R296  100  R-US_0204/5  [0204/5]
R297  100  R-US_0204/5  [0204/5]
R298  1k  R-US_0204/5  [0204/5]
R299  1k  R-US_0204/5  [0204/5]
R300  100  R-US_0204/5  [0204/5]
R301  100  R-US_0204/5  [0204/5]
R302  1k  R-US_0204/5  [0204/5]
R303  1k  R-US_0204/5  [0204/5]
R304  100  R-US_0204/5  [0204/5]
R305  100  R-US_0204/5  [0204/5]
R306  1k  R-US_0204/5  [0204/5]
R307  1k  R-US_0204/5  [0204/5]
R308  100  R-US_0204/5  [0204/5]
R309  100  R-US_0204/5  [0204/5]
R310  1k  R-US_0204/5  [0204/5]
R311  1k  R-US_0204/5  [0204/5]
R312  100  R-US_0204/5  [0204/5]
R313  100  R-US_0204/5  [0204/5]
R314  1k  R-US_0204/5  [0204/5]
R315  1k  R-US_0204/5  [0204/5]
R316  100  R-US_0204/5  [0204/5]
R317  100  R-US_0204/5  [0204/5]
R318  1k  R-US_0204/5  [0204/5]
R319  1k  R-US_0204/5  [0204/5]
R320  100  R-US_0204/5  [0204/5]
R321  100  R-US_0204/5  [0204/5]
R322  1k  R-US_0204/5  [0204/5]
R323  1k  R-US_0204/5  [0204/5]
R324  100  R-US_0204/5  [0204/5]
R325  100  R-US_0204/5  [0204/5]
R326  1k  R-US_0204/5  [0204/5]
R327  1k  R-US_0204/5  [0204/5]
R328  100  R-US_0204/5  [0204/5]
R329  100  R-US_0204/5  [0204/5]
R330  1k  R-US_0204/5  [0204/5]
R331  1k  R-US_0204/5  [0204/5]
R332  100  R-US_0204/5  [0204/5]
R333  100  R-US_0204/5  [0204/5]
R334  1k  R-US_0204/5  [0204/5]
R335  1k  R-US_0204/5  [0204/5]
R336  100  R-US_0204/5  [0204/5]
R337  100  R-US_0204/5  [0204/5]
R338  1k  R-US_0204/5  [0204/5]
R339  1k  R-US_0204/5  [0204/5]
R340  100  R-US_0204/5  [0204/5]
R341  100  R-US_0204/5  [0204/5]
R342  1k  R-US_0204/5  [0204/5]
R343  1k  R-US_0204/5  [0204/5]
R344  100  R-US_0204/5  [0204/5]
R345  100  R-US_0204/5  [0204/5]
R346  1k  R-US_0204/5  [0204/5]
R347  1k  R-US_0204/5  [0204/5]
R348  100  R-US_0204/5  [0204/5]
R349  100  R-US_0204/5  [0204/5]
R350  1k  R-US_0204/5  [0204/5]
R351  1k  R-US_0204/5  [0204/5]
R352  100  R-US_0204/5  [0204/5]
R353  100  R-US_0204/5  [0204/5]
R354  1k  R-US_0204/5  [0204/5]
R355  1k  R-US_0204/5  [0204/5]
R356  100  R-US_0204/5  [0204/5]
R357  100  R-US_0204/5  [0204/5]
R358  1k  R-US_0204/5  [0204/5]
R359  1k  R-US_0204/5  [0204/5]
R360  100  R-US_0204/5  [0204/5]
R361  100  R-US_0204/5  [0204/5]
R362  1k  R-US_0204/5  [0204/5]
R363  1k  R-US_0204/5  [0204/5]
R364  100  R-US_0204/5  [0204/5]
R365  100  R-US_0204/5  [0204/5]
R366  1k  R-US_0204/5  [0204/5]
R367  1k  R-US_0204/5  [0204/5]
R368  100  R-US_0204/5  [0204/5]
R369  100  R-US_0204/5  [0204/5]
R370  1k  R-US_0204/5  [0204/5]
R371  1k  R-US_0204/5  [0204/5]
R372  100  R-US_0204/5  [0204/5]
R373  100  R-US_0204/5  [0204/5]
R374  1k  R-US_0204/5  [0204/5]
R375  1k  R-US_0204/5  [0204/5]
R376  100  R-US_0204/5  [0204/5]
R377  100  R-US_0204/5  [0204/5]
R378  1k  R-US_0204/5  [0204/5]
R379  1k  R-US_0204/5  [0204/5]
R380  100  R-US_0204/5  [0204/5]
R381  100  R-US_0204/5  [0204/5]
R382  1k  R-US_0204/5  [0204/5]
R383  1k  R-US_0204/5  [0204/5]
R384  100  R-US_0204/5  [0204/5]
R385  100  R-US_0204/5  [0204/5]
R386  1k  R-US_0204/5  [0204/5]
R387  1k  R-US_0204/5  [0204/5]
R388  100  R-US_0204/5  [0204/5]
R389  100  R-US_0204/5  [0204/5]
R390  1k  R-US_0204/5  [0204/5]
R391  1k  R-US_0204/5  [0204/5]
R392  100  R-US_0204/5  [0204/5]
R393  100  R-US_0204/5  [0204/5]
R394  1k  R-US_0204/5  [0204/5]
R395  1k  R-US_0204/5  [0204/5]
R396  100  R-US_0204/5  [0204/5]
R397  100  R-US_0204/5  [0204/5]
R398  1k  R-US_0204/5  [0204/5]
R399  1k  R-US_0204/5  [0204/5]
R400  100  R-US_0204/5  [0204/5]
R401  100  R-US_0204/5  [0204/5]
R402  1k  R-US_0204/5  [0204/5]
R403  1k  R-US_0204/5  [0204/5]
R404  100  R-US_0204/5  [0204/5]
R405  100  R-US_0204/5  [0204/5]
R406  1k  R-US_0204/5  [0204/5]
R407  1k  R-US_0204/5  [0204/5]
R408  100  R-US_0204/5  [0204/5]
R409  100  R-US_0204/5  [0204/5]
R410  1k  R-US_0204/5  [0204/5]
R411  1k  R-US_0204/5  [0204/5]
R412  100  R-US_0204/5  [0204/5]
R413  100  R-US_0204/5  [0204/5]
R414  1k  R-US_0204/5  [0204/5]
R415  1k  R-US_0204/5  [0204/5]
R416  100  R-US_0204/5  [0204/5]
R417  100  R-US_0204/5  [0204/5]
R418  1k  R-US_0204/5  [0204/5]
R419  1k  R-US_0204/5  [0204/5]
R420  100  R-US_0204/5  [0204/5]
R421  100  R-US_0204/5  [0204/5]
R422  1k  R-US_0204/5  [0204/5]
R423  1k  R-US_0204/5  [0204/5]
R424  100  R-US_0204/5  [0204/5]
R425  100  R-US_0204/5  [0204/5]
R426  1k  R-US_0204/5  [0204/5]
R427  1k  R-US_0204/5  [0204/5]
R428  100  R-US_0204/5  [0204/5]
R429  100  R-US_0204/5  [0204/5]
R430  1k  R-US_0204/5  [0204/5]
R431  1k  R-US_0204/5  [0204/5]
R432  100  R-US_0204/5  [0204/5]
R433  100  R-US_0204/5  [0204/5]
R434  1k  R-US_0204/5  [0204/5]
R435  1k  R-US_0204/5  [0204/5]
R436  100  R-US_0204/5  [0204/5]
R437  100  R-US_0204/5  [0204/5]
R438  1k  R-US_0204/5  [0204/5]
R439  1k  R-US_0204/5  [0204/5]
R440  100  R-US_0204/5  [0204/5]
R441  100  R-US_0204/5  [0204/5]
R442  1k  R-US_0204/5  [0204/5]
R443  1k  R-US_0204/5  [0204/5]
R444  100  R-US_0204/5  [0204/5]
R445  100  R-US_0204/5  [0204/5]
R446  1k  R-US_0204/5  [0204/5]
R447  1k  R-US_0204/5  [0204/5]
R448  100  R-US_0204/5  [0204/5]
R449  100  R-US_0204/5  [0204/5]
R450  1k  R-US_0204/5  [0204/5]
R451  1k  R-US_0204/5  [0204/5]
R452  100  R-US_0204/5  [0204/5]
R453  100  R-US_0204/5  [0204/5]
R454  1k  R-US_0204/5  [0204/5]
R455  1k  R-US_0204/5  [0204/5]
R456  100  R-US_0204/5  [0204/5]
R457  100  R-US_0204/5  [0204/5]
R458  1k  R-US_0204/5  [0204/5]
R459  1k  R-US_0204/5  [0204/5]
R460  100  R-US_0204/5  [0204/5]
R461  100  R-US_0204/5  [0204/5]
R462  1k  R-US_0204/5  [0204/5]
R463  1k  R-US_0204/5  [0204/5]
R464  100  R-US_0204/5  [0204/5]
R465  100  R-US_0204/5  [0204/5]
R466  1k  R-US_0204/5  [0204/5]
R467  1k  R-US_0204/5  [0204/5]
R468  100  R-US_0204/5  [0204/5]
R469  100  R-US_0204/5  [0204/5]
R470  1k  R-US_0204/5  [0204/5]
R471  1k  R-US_0204/5  [0204/5]
R472  100  R-US_0204/5  [0204/5]
R473  100  R-US_0204/5  [0204/5]
R474  1k  R-US_0204/5  [0204/5]
R475  1k  R-US_0204/5  [0204/5]
R476  100  R-US_0204/5  [0204/5]
R477  100  R-US_0204/5  [0204/5]
R478  1k  R-US_0204/5  [0204/5]
R479  1k  R-US_0204/5  [0204/5]
R480  100  R-US_0204/5  [0204/5]
R481  100  R-US_0204/5  [0204/5]
R482  1k  R-US_0204/5  [0204/5]
R483  1k  R-US_0204/5  [0204/5]
R484  100  R-US_0204/5  [0204/5]
R485  100  R-US_0204/5  [0204/5]
R486  1k  R-US_0204/5  [0204/5]
R487  1k  R-US_0204/5  [0204/5]
R488  100  R-US_0204/5  [0204/5]
R489  100  R-US_0204/5  [0204/5]
R490  1k  R-US_0204/5  [0204/5]
R491  1k  R-US_0204/5  [0204/5]
R492  100  R-US_0204/5  [0204/5]
R493  100  R-US_0204/5  [0204/5]
R494  1k  R-US_0204/5  [0204/5]
R495  1k  R-US_0204/5  [0204/5]
R496  100  R-US_0204/5  [0204/5]
R497  100  R-US_0204/5  [0204/5]
R498  1k  R-US_0204/5  [0204/5]
R499  1k  R-US_0204/5  [0204/5]
R500  100  R-US_0204/5  [0204/5]
R501  100  R-US_0204/5  [0204/5]
R502  1k  R-US_0204/5  [0204/5]
R503  1k  R-US_0204/5  [0204/5]
R504  100  R-US_0204/5  [0204/5]
R505  100  R-US_0204/5  [0204/5]
R506  1k  R-US_0204/5  [0204/5]
R507  1k  R-US_0204/5  [0204/5]
R508  100  R-US_0204/5  [0204/5]
R509  100  R-US_0204/5  [0204/5]
R510  1k  R-US_0204/5  [0204/5]
R511  1k  R-US_0204/5  [0204/5]
R512  100  R-US_0204/5  [0204/5]
R513  100  R-US_0204/5  [0204/5]
R514  1k  R-US_0204/5  [0204/5]
R515  1k  R-US_0204/5  [0204/5]
R516  100  R-US_0204/5  [0204/5]
R517  100  R-US_0204/5  [0204/5]
R518  1k  R-US_0204/5  [0204/5]
R519  1k  R-US_0204/5  [0204/5]
R520  100  R-US_0204/5  [0204/5]
R521  100  R-US_0204/5  [0204/5]
R522  1k  R-US_0204/5  [0204/5]
R523  1k  R-US_0204/5  [0204/5]
R524  100  R-US_0204/5  [0204/5]
R525  100  R-US_0204/5  [0204/5]
R526  1k  R-US_0204/5  [0204/5]
R527  1k  R-US_0204/5  [0204/5]
R528  100  R-US_0204/5  [0204/5]
R529  100  R-US_0204/5  [0204/5]
R530  1k  R-US_0204/5  [0204/5]
R531  1k  R-US_0204/5  [0204/5]
R532  100  R-US_0204/5  [0204/5]
R533  100  R-US_0204/5  [0204/5]
R534  1k  R-US_0204/5  [0204/5]
R535  1k  R-US_0204/5  [0204/5]
R536  100  R-US_0204/5  [0204/5]
R537  100  R-US_0204/5  [0204/5]
R538  1k  R-US_0204/5  [0204/5]
R539  1k  R-US_0204/5  [0204/5]
R540  100  R-US_0204/5  [0204/5]
R541  1k  R-US_0204/5  [0204/5]
R542  1k  R-US_0204/5  [0204/5]
R543  1k  R-US_0204/5  [0204/5]
R544  100  R-US_0204/5  [0204/5]
R545  1k  R-US_0204/5  [0204/5]
R546  1k  R-US_0204/5  [0204/5]
R547  1k  R-US_0204/5  [0204/5]
R548  100  R-US_0204/5  [0204/5]
R549  100  R-US_0204/5  [0204/5]
R550  1k  R-US_0204/5  [0204/5]
R551  1k  R-US_0204/5  [0204/5]
R552  100  R-US_0204/5  [0204/5]
R553  1k  R-US_0204/5  [0204/5]
R554  1k  R-US_0204/5  [0204/5]
R555  1k  R-US_0204/5  [0204/5]
R556  100  R-US_0204/5  [0204/5]
R557  1k  R-US_0204/5  [0204/5]
R558  1k  R-US_0204/5  [0204/5]
R559  1k  R-US_0204/5  [0204/5]
R560  100  R-US_0204/5  [0204/5]
R561  100  R-US_0204/5  [0204/5]
R562  1k  R-US_0204/5  [0204/5]
R563  1k  R-US_0204/5  [0204/5]
R564  100  R-US_0204/5  [0204/5]
R565  1k  R-US_0204/5  [0204/5]
R566  1k  R-US_0204/5  [0204/5]
R567  1k  R-US_0204/5  [0204/5]
R568  100  R-US_0204/5  [0204/5]
R569  1k  R-US_0204/5  [0204/5]
R570  100  R-US_0204/5  [0204/5]
R571  1k  R-US_0204/5  [0204/5]
R572  1k  R-US_0204/5  [0204/5]
R573  100  R-US_0204/5  [0204/5]
R574  1k  R-US_0204/5  [0204/5]
R575  1k  R-US_0204/5  [0204/5]
R576  100  R-US_0204/5  [0204/5]
R577  1k  R-US_0204/5  [0204/5]
R578  1k  R-US_0204/5  [0204/5]
R579  100  R-US_0204/5  [0204/5]
R580  1k  R-US_0204/5  [0204/5]
R581  1k  R-US_0204/5  [0204/5]
R582  100  R-US_0204/5  [0204/5]
R583  1k  R-US_0204/5  [0204/5]
R584  1k  R-US_0204/5  [0204/5]
R585  100  R-US_0204/5  [0204/5]
R586  1k  R-US_0204/5  [0204/5]
R587  1k  R-US_0204/5  [0204/5]
R588  100  R-US_0204/5  [0204/5]
R589  1k  R-US_0204/5  [0204/5]
R590  1k  R-US_0204/5  [0204/5]
R591  100  R-US_0204/5  [0204/5]
R592  1k  R-US_0204/5  [0204/5]
R593  1k  R-US_0204/5  [0204/5]
R594  100  R-US_0204/5  [0204/5]
R595  1k  R-US_0204/5  [0204/5]
R596  1k  R-US_0204/5  [0204/5]
R597  100  R-US_0204/5  [0204/5]
R598  1k  R-US_0204/5  [0204/5]
R599  1k  R-US_0204/5  [0204/5]
R600  100  R-US_0204/5  [0204/5]
R601  1k  R-US_0204/5  [0204/5]
R602  1k  R-US_0204/5  [0204/5]
R603  100  R-US_0204/5  [0204/5]
R604  1k  R-US_0204/5  [0204/5]
R605  1k  R-US_0204/5  [0204/5]
R606  100  R-US_0204/5  [0204/5]
R607  1k  R-US_0204/5  [0204/5]
R608  1k  R-US_0204/5  [0204/5]
R609  100  R-US_0204/5  [0204/5]
R610  1k  R-US_0204/5  [0204/5]
R611  1k  R-US_0204/5  [0204/5]
R612  100  R-US_0204/5  [0204/5]
R613  1k  R-US_0204/5  [0204/5]
R614  1k  R-US_0204/5  [0204/5]
R615  100  R-US_0204/5  [0204/5]
R616  1k  R-US_0204/5  [0204/5]
R617  1k  R-US_0204/5  [0204/5]
R618  100  R-US_0204/5  [0204/5]
R619  1k  R-US_0204/5  [0204/5]
R620  1k  R-US_0204/5  [0204/5]
R621  100  R-US_0204/5  [0204/5]
R622  1k  R-US_0204/5  [0204/5]
R623  1k  R-US_0204/5  [0204/5]
R624  100  R-US_0204/5  [0204/5]
R625  1k  R-US_0204/5  [0204/5]
R626  1k  R-US_0204/5  [0204/5]
R627  100  R-US_0204/5  [0204/5]
R628  1k  R-US_0204/5  [0204/5]
R629  1k  R-US_0204/5  [0204/5]
R630  100  R-US_0204/5  [0204/5]
R631  1k  R-US_0204/5  [0204/5]
R632  1k  R-US_0204/5  [0204/5]
R633  100  R-US_0204/5  [0204/5]
R634  1k  R-US_0204/5  [0204/5]
R635  1k  R-US_0204/5  [0204/5]
R636  100  R-US_0204/5  [0204/5]
R637  1k  R-US_0204/5  [0204/5]
R638  1k  R-US_0204/5  [0204/5]
R639  100  R-US_0204/5  [0204/5]
R640  1k  R-US_0204/5  [0204/5]
R641  1k  R-US_0204/5  [0204/5]
R642  100  R-US_0204/5  [0204/5]
R643  1k  R-US_0204/5  [0204/5]
R644  1k  R-US_0204/5  [0204/5]
R645  100  R-US_0204/5  [0204/5]
R646  1k  R-US_0204/5  [0204/5]
R647  1k  R-US_0204/5  [0204/5]
R648  100  R-US_0204/5  [0204/5]
R649  1k  R-US_0204/5  [0204/5]
R650  1k  R-US_0204/5  [0204/5]
R651  100  R-US_0204/5  [0204/5]
R652  1k  R-US_0204/5  [0204/5]
R653  1k  R-US_0204/5  [0204/5]
R654  100  R-US_0204/5  [0204/5]
R655  1k  R-US_0204/5  [0204/5]
R656  1k  R-US_0204/5  [0204/5]
R657  100  R-US_0204/5  [0204/5]
R658  1k  R-US_0204/5  [0204/5]
R659  1k  R-US_0204/5  [0204/5]
R660  100  R-US_0204/5  [0204/5]
R661  1k  R-US_0204/5  [0204/5]
R662  1k  R-US_0204/5  [0204/5]
R663  100  R-US_0204/5  [0204/5]
R664  1k  R-US_0204/5  [0204/5]
R665  1k  R-US_0204/5  [0204/5]
R666  100  R-US_0204/5  [0204/5]
R667  1k  R-US_0204/5  [0204/5]
R668  1k  R-US_0204/5  [0204/5]
R669  100  R-US_0204/5  [0204/5]
R670  1k  R-US_0204/5  [0204/5]
R671  1k  R-US_0204/5  [0204/5]
R672  100  R-US_0204/5  [0204/5]
R673  1k  R-US_0204/5  [0204/5]
R674  1k  R-US_0204/5  [0204/5]
R675  100  R-US_0204/5  [0204/5]
R676  1k  R-US_0204/5  [0204/5]
R677  1k  R-US_0204/5  [0204/5]
R678  100  R-US_0204/5  [0204/5]
R679  1k  R-US_0204/5  [0204/5]
R680  1k  R-US_0204/5  [0204/5]
R681  100  R-US_0204/5  [0204/5]
R682  1k  R-US_0204/5  [0204/5]
R683  1k  R-US_0204/5  [0204/5]
R684  100  R-US_0204/5  [0204/5]
R685  1k  R-US_0204/5  [0204/5]
R686  1k  R-US_0204/5  [0204/5]
R687  100  R-US_0204/5  [0204/5]
R688  1k  R-US_0204/5  [0204/5]
R689  1k  R-US_0204/5  [0204/5]
R690  100  R-US_0204/5  [0204/5]
R691  1k  R-US_0204/5  [0204/5]
R692  1k  R-US_0204/5  [0204/5]
R693  100  R-US_0204/5  [0204/5]
R694  1k  R-US_0204/5  [0204/5]
R695  1k  R-US_0204/5  [0204/5]
R696  100  R-US_0204/5  [0204/5]
R697  1k  R-US_0204/5  [0204/5]
R698  1k  R-US_0204/5  [0204/5]
R699  100  R-US_0204/5  [0204/5]
R700  1k  R-US_0204/5  [0204/5]
R701  1k  R-US_0204/5  [0204/5]
R702  100  R-US_0204/5  [0204/5]
R703  1k  R-US_0204/5  [0204/5]
R704  1k  R-US_0204/5  [0204/5]
R705  100  R-US_0204/5  [0204/5]
R706  1k  R-US_0204/5  [0204/5]
R707  1k  R-US_0204/5  [0204/5]
R708  100  R-US_0204/5  [0204/5]
R709  1k  R-US_0204/5  [0204/5]
R710  1k  R-US_0204/5  [0204/5]
R711  100  R-US_0204/5  [0204/5]
R712  1k  R-US_0204/5  [0204/5]
R713  1k  R-US_0204/5  [0204/5]
R714  100  R-US_0204/5  [0204/5]
R715  1k  R-US_0204/5  [0204/5]
R716  1k  R-US_0204/5  [0204/5]
R717  100  R-US_0204/5  [0204/5]
R718  1k  R-US_0204/5  [0204/5]
R719  1k  R-US_0204/5  [0204/5]
R720  100  R-US_0204/5  [0204/5]
R721  1k  R-US_0204/5  [0204/5]
R722  1k  R-US_0204/5  [0204/5]
R723  100  R-US_0204/5  [0204/5]
R724  1k  R-US_0204/5  [0204/5]
R725  1k  R-US_0204/5  [0204/5]
R726  100  R-US_0204/5  [0204/5]
R727  1k  R-US_0204/5  [0204/5]
R728  1k  R-US_0204/5  [0204/5]
R729  100  R-US_0204/5  [0204/5]
R730  10k  R-US_0204/5  [0204/5]
SV1  MA04-1  [MA04-1]
SV2  MA05-1  [MA05-1]
T1  2N3904  [TO92]
T2  2N3904  [TO92]
T3  2N3904  [TO92]
T4  2N3904  [TO92]
T5  2N3904  [TO92]
T6  2N3904  [TO92]
T7  2N3904  [TO92]
T8  2N3904  [TO92]
T9  2N3904  [TO92]
T10  2N3904  [TO92]
T11  2N3904  [TO92]
T12  2N3904  [TO92]
T13  2N3904  [TO92]
T14  2N3904  [TO92]
T15  2N3904  [TO92]
T16  2N3904  [TO92]
T17  2N3904  [TO92]
T18  2N3904  [TO92]
T19  2N3904  [TO92]
T20  2N3904  [TO92]
T21  2N3904  [TO92]
T22  2N3904  [TO92]
T23  2N3904  [TO92]
T24  2N3904  [TO92]
T25  2N3904  [TO92]
T26  2N3904  [TO92]
T27  2N3904  [TO92]
T28  2N3904  [TO92]
T29  2N3904  [TO92]
T30  2N3904  [TO92]
T31  2N3904  [TO92]
T32  2N3904  [TO92]
T33  2N3904  [TO92]
T34  2N3904  [TO92]
T35  2N3904  [TO92]
T36  2N3904  [TO92]
T37  2N3904  [TO92]
T38  2N3904  [TO92]
T39  2N3904  [TO92]
T40  2N3904  [TO92]
T41  2N3904  [TO92]
T42  2N3904  [TO92]
T43  2N3904  [TO92]
T44  2N3904  [TO92]
T45  2N3904  [TO92]
T46  2N3904  [TO92]
T47  2N3904  [TO92]
T48  2N3904  [TO92]
T49  2N3904  [TO92]
T50  2N3904  [TO92]
T51  2N3904  [TO92]
T52  2N3904  [TO92]
T53  2N3904  [TO92]
T54  2N3904  [TO92]
T55  2N3904  [TO92]
T56  2N3904  [TO92]
T57  2N3904  [TO92]
T58  2N3904  [TO92]
T59  2N3904  [TO92]
T60  2N3904  [TO92]
T61  2N3904  [TO92]
T62  2N3904  [TO92]
T63  2N3904  [TO92]
T64  2N3904  [TO92]
T65  2N3904  [TO92]
T66  2N3904  [TO92]
T67  2N3904  [TO92]
T68  2N3904  [TO92]
T69  2N3904  [TO92]
T70  2N3904  [TO92]
T71  2N3904  [TO92]
T72  2N3904  [TO92]
T73  2N3904  [TO92]
T74  2N3904  [TO92]
T75  2N3904  [TO92]
T76  2N3904  [TO92]
T77  2N3904  [TO92]
T78  2N3904  [TO92]
T79  2N3904  [TO92]
T80  2N3904  [TO92]
T81  2N3904  [TO92]
T82  2N3904  [TO92]
T83  2N3904  [TO92]
T84  2N3904  [TO92]
T85  2N3904  [TO92]
T86  2N3904  [TO92]
T87  2N3904  [TO92]
T88  2N3904  [TO92]
T89  2N3904  [TO92]
T90  2N3904  [TO92]
T91  2N3904  [TO92]
T92  2N3904  [TO92]
T93  2N3904  [TO92]
T94  2N3904  [TO92]
T95  2N3904  [TO92]
T96  2N3904  [TO92]
T97  2N3904  [TO92]
T98  2N3904  [TO92]
T99  2N3904  [TO92]
T100  2N3904  [TO92]
T101  2N3904  [TO92]
T102  2N3904  [TO92]
T103  2N3904  [TO92]
T104  2N3904  [TO92]
T105  2N3904  [TO92]
T106  2N3904  [TO92]
T107  2N3904  [TO92]
T108  2N3904  [TO92]
T109  2N3904  [TO92]
T110  2N3904  [TO92]
T111  2N3904  [TO92]
T112  2N3904  [TO92]
T113  2N3904  [TO92]
T114  2N3904  [TO92]
T115  2N3904  [TO92]
T116  2N3904  [TO92]
T117  2N3904  [TO92]
T118  2N3904  [TO92]
T119  2N3904  [TO92]
T120  2N3904  [TO92]
T121  2N3904  [TO92]
T122  2N3904  [TO92]
T123  2N3904  [TO92]
T124  2N3904  [TO92]
T125  2N3904  [TO92]
T126  2N3904  [TO92]
T127  2N3904  [TO92]
T128  2N3904  [TO92]
T129  2N3904  [TO92]
T130  2N3904  [TO92]
T131  2N3904  [TO92]
T132  2N3904  [TO92]
T133  2N3904  [TO92]
T134  2N3904  [TO92]
T135  2N3904  [TO92]
T136  2N3904  [TO92]
T137  2N3904  [TO92]
T138  2N3904  [TO92]
T139  2N3904  [TO92]
T140  2N3904  [TO92]
T141  2N3904  [TO92]
T142  2N3904  [TO92]
T143  2N3904  [TO92]
T144  2N3904  [TO92]
T145  2N3904  [TO92]
T146  2N3904  [TO92]
T147  2N3904  [TO92]
T148  2N3904  [TO92]
T149  2N3904  [TO92]
T150  2N3904  [TO92]
T151  2N3904  [TO92]
T152  2N3904  [TO92]
T153  2N3904  [TO92]
T154  2N3904  [TO92]
T155  2N3904  [TO92]
T156  2N3904  [TO92]
T157  2N3904  [TO92]
T158  2N3904  [TO92]
T159  2N3904  [TO92]
T160  2N3904  [TO92]
T161  2N3904  [TO92]
T162  2N3904  [TO92]
T163  2N3904  [TO92]
T164  2N3904  [TO92]
T165  2N3904  [TO92]
T166  2N3904  [TO92]
T167  2N3904  [TO92]
T168  2N3904  [TO92]
T169  2N3904  [TO92]
T170  2N3904  [TO92]
T171  2N3904  [TO92]
T172  2N3904  [TO92]
T173  2N3904  [TO92]
T174  2N3904  [TO92]
T175  2N3904  [TO92]
T176  2N3904  [TO92]
T177  2N3904  [TO92]
T178  2N3904  [TO92]
T179  2N3904  [TO92]
T180  2N3904  [TO92]
T181  2N3904  [TO92]
T182  2N3904  [TO92]
T183  2N3904  [TO92]
T184  2N3904  [TO92]
T185  2N3904  [TO92]
T186  2N3904  [TO92]
T187  2N3904  [TO92]
T188  2N3904  [TO92]
T189  2N3904  [TO92]
T190  2N3904  [TO92]
T191  2N3904  [TO92]
T192  2N3904  [TO92]
T193  2N3904  [TO92]
T194  2N3904  [TO92]
T195  2N3904  [TO92]
T196  2N3904  [TO92]
T197  2N3904  [TO92]
T198  2N3904  [TO92]
T199  2N3904  [TO92]
T200  2N3904  [TO92]